# Altium project B106AA.PrjPcb (part 2 of 5)

## Sheet FOTA MicroController.SchDoc: FOTA MicroController
size A4; ApprovedBy: Mehmet Günce Akkoyun; CheckedBy: Mehmet Günce Akkoyun; Author: Mehmet Günce Akkoyun; CompanyName: Ovoo Electronics; DrawnBy: Mehmet Günce Akkoyun; Engineer: Mehmet Günce Akkoyun; Organization: Ovoo Electronics; Address1: Küçük Ýhsaniye Mah.; Address2: Mýzraklý Sok. No:15; Address3: Meram / Konya; Address4: Turkiye; DocumentNumber: AA005; Revision: B106AA; SheetNumber: 21; SheetTotal: 37
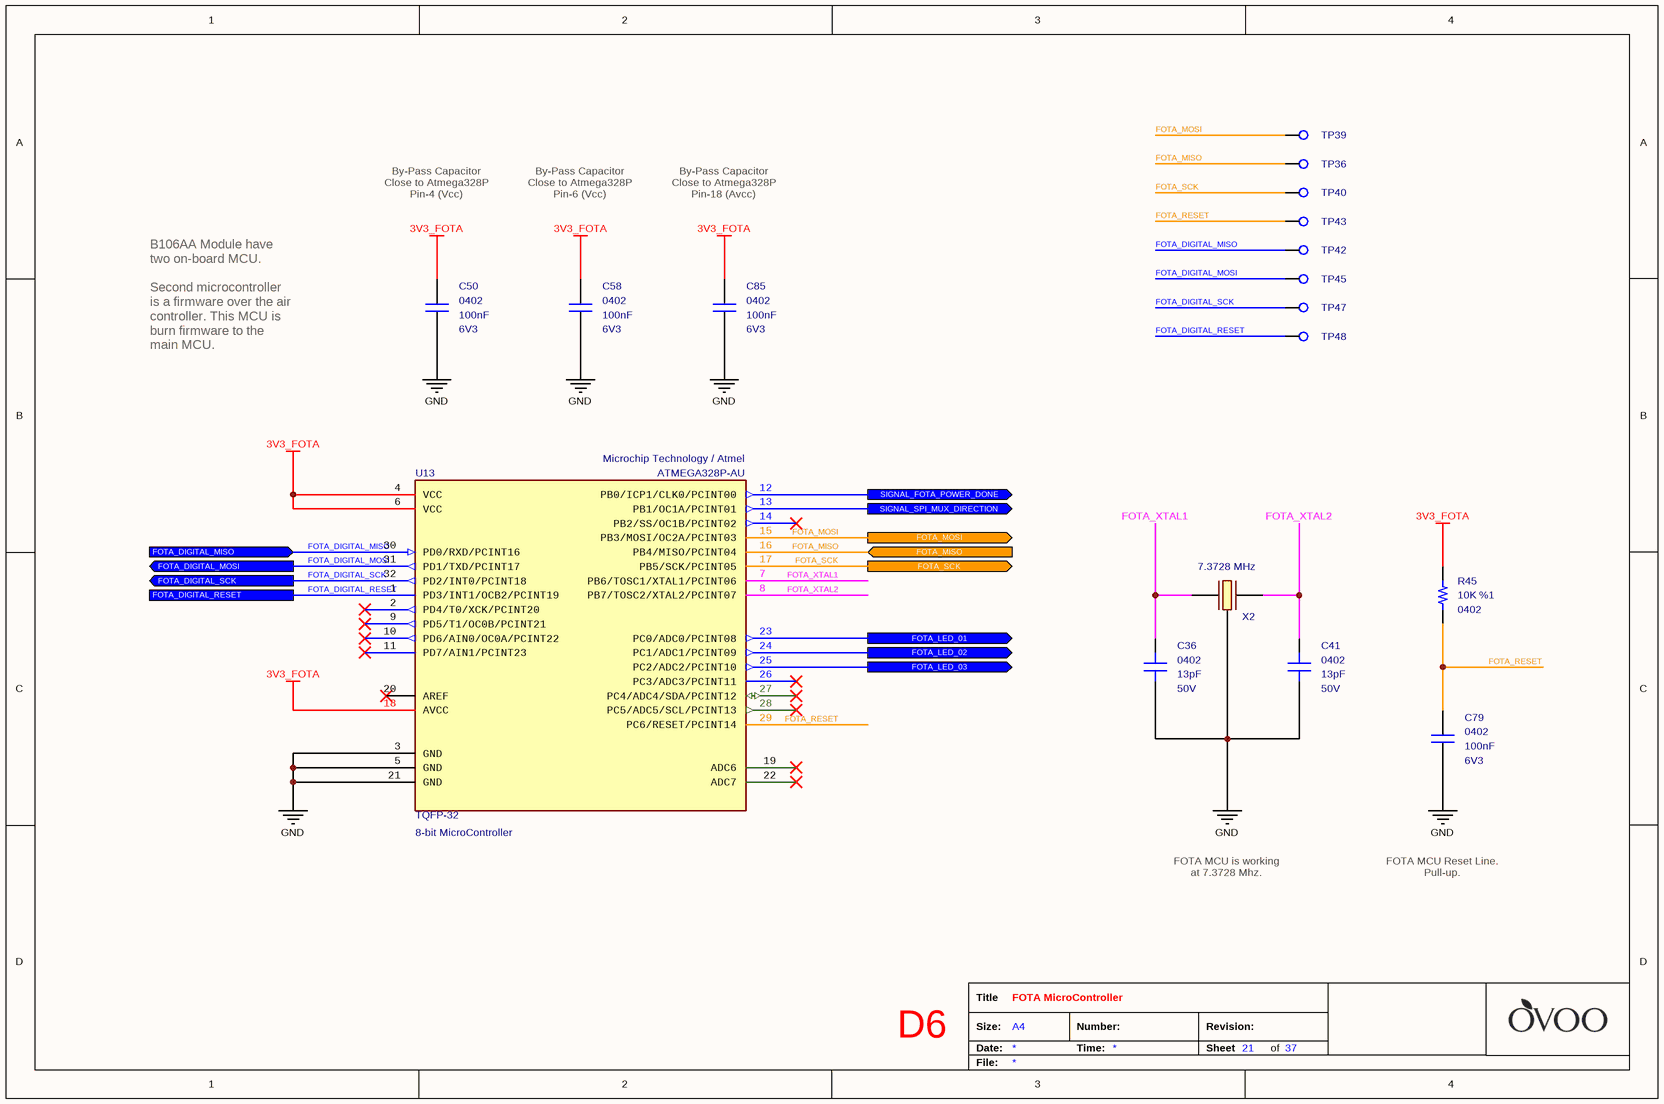
[diagram p10: FOTA MicroController.SchDoc]

### Parts
C36  value 13pF  Voltage: 50V  Case: 0402  [CAPACITOR_0402]  (hidden comment: Multilayer Ceramic Capacitors)
C41  value 13pF  Voltage: 50V  Case: 0402  [CAPACITOR_0402]  (hidden comment: Multilayer Ceramic Capacitors)
C50  value 100nF  Case: 0402  Voltage: 6V3  [CAPACITOR_0402]  (hidden comment: Multilayer Ceramic Capacitor)
C58  value 100nF  Case: 0402  Voltage: 6V3  [CAPACITOR_0402]  (hidden comment: Multilayer Ceramic Capacitor)
C79  value 100nF  Case: 0402  Voltage: 6V3  [CAPACITOR_0402]  (hidden comment: Multilayer Ceramic Capacitor)
C85  value 100nF  Case: 0402  Voltage: 6V3  [CAPACITOR_0402]  (hidden comment: Multilayer Ceramic Capacitor)
R45  value 10K  Tolerance: %1  Case: 0402  [RESISTOR_0402]  (hidden comment: Thick Film Resistor)
TP36  PCB - Test Point  [Test_Pad - Hole]  (value not drawn)  (no BOM)
TP39  PCB - Test Point  [Test_Pad - Hole]  (value not drawn)  (no BOM)
TP40  PCB - Test Point  [Test_Pad - Hole]  (value not drawn)  (no BOM)
TP42  PCB - Test Point  [Test_Pad - Hole]  (value not drawn)  (no BOM)
TP43  PCB - Test Point  [Test_Pad - Hole]  (value not drawn)  (no BOM)
TP45  PCB - Test Point  [Test_Pad - Hole]  (value not drawn)  (no BOM)
TP47  PCB - Test Point  [Test_Pad - Hole]  (value not drawn)  (no BOM)
TP48  PCB - Test Point  [Test_Pad - Hole]  (value not drawn)  (no BOM)
U13  8-bit MicroController  Manufacturer_Part_Number: ATMEGA328P-AU  Manufacturer_Name: Microchip Technology / Atmel  Case: TQFP-32  [TQFP32]
X2  7.3728 MHz  [ABRACON_CRYSTAL]

### Ports
FOTA_DIGITAL_MISO (in), FOTA_DIGITAL_MOSI (out), FOTA_DIGITAL_RESET, FOTA_DIGITAL_SCK (out), FOTA_LED_01 (out), FOTA_LED_02 (out), FOTA_LED_03 (out), FOTA_MISO (in), FOTA_MOSI (out), FOTA_SCK (out), SIGNAL_FOTA_POWER_DONE (out), SIGNAL_SPI_MUX_DIRECTION (out)

### Nets
3V3_FOTA: C50.2 C58.2 C85.2 R45.2 U13.4(VCC) U13.6(VCC) U13.18(AVCC)
GND: C36.1 C41.1 C50.1 C58.1 C79.1 C85.1 U13.3(GND) U13.5(GND) U13.21(GND) X2.2(GND)
FOTA_DIGITAL_MISO: TP42.1 U13.30(PD0/RXD/PCINT16) ; port FOTA_DIGITAL_MISO
FOTA_DIGITAL_MOSI: TP45.1 U13.31(PD1/TXD/PCINT17) ; port FOTA_DIGITAL_MOSI
FOTA_DIGITAL_RESET: TP48.1 U13.1(PD3/INT1/OCB2/PCINT19) ; port FOTA_DIGITAL_RESET
FOTA_DIGITAL_SCK: TP47.1 U13.32(PD2/INT0/PCINT18) ; port FOTA_DIGITAL_SCK
FOTA_MISO: TP36.1 U13.16(PB4/MISO/PCINT04) ; port FOTA_MISO
FOTA_MOSI: TP39.1 U13.15(PB3/MOSI/OC2A/PCINT03) ; port FOTA_MOSI
FOTA_RESET: C79.2 R45.1 TP43.1 U13.29(PC6/RESET/PCINT14)
FOTA_SCK: TP40.1 U13.17(PB5/SCK/PCINT05) ; port FOTA_SCK
FOTA_XTAL1: C36.2 U13.7(PB6/TOSC1/XTAL1/PCINT06) X2.3(OUT/IN)
FOTA_XTAL2: C41.2 U13.8(PB7/TOSC2/XTAL2/PCINT07) X2.1(IN/OUT)
NetC25_1: U13.23(PC0/ADC0/PCINT08) ; port FOTA_LED_01
NetC30_2: U13.12(PB0/ICP1/CLK0/PCINT00) ; port SIGNAL_FOTA_POWER_DONE
NetC39_1: U13.24(PC1/ADC1/PCINT09) ; port FOTA_LED_02
NetC67_1: U13.25(PC2/ADC2/PCINT10) ; port FOTA_LED_03
NetC69_2: U13.13(PB1/OC1A/PCINT01) ; port SIGNAL_SPI_MUX_DIRECTION

Not connected (* = marked no-connect by the designer): U13 2(PD4/T0/XCK/PCINT20)* 9(PD5/T1/OC0B/PCINT21)* 10(PD6/AIN0/OC0A/PCINT22)* 11(PD7/AIN1/PCINT23)* 14(PB2/SS/OC1B/PCINT02)* 19(ADC6)* 20(AREF)* 22(ADC7)* 26(PC3/ADC3/PCINT11)* 27(PC4/ADC4/SDA/PCINT12)* 28(PC5/ADC5/SCL/PCINT13)*; X2 4(GND)

### Notes on the sheet
- By-Pass Capacitor
  Close to Atmega328P
  Pin-4 (Vcc)
- By-Pass Capacitor
  Close to Atmega328P
  Pin-6 (Vcc)
- By-Pass Capacitor
  Close to Atmega328P
  Pin-18 (Avcc)
- B106AA Module have two on-board MCU.
  Second microcontroller is a firmware over the air controller. This MCU is burn firmware to the main MCU.
- FOTA MCU is working at 7.3728 Mhz.
- FOTA MCU Reset Line. Pull-up.
- D6
- Title
- Size:
- Date:
- A4
- Number:
- Time:
- Revision:
- Sheet
- of
- File:

### Library data of the parts
C36 C41 = Capacitor - 13pF [0402-50V): Capacitor - 13pF [0402] (Ceramic); Manufacturer_Name: Kemet; Manufacturer_Part_Number: CBR04C130F5GAC; Dielectric: C0G; Tolerance: 1%; Height: 0.55mm; Mouser_Part_Number: 80-CBR04C130F5GAC; ROHS: Yes; Weight: 0.65mg; ComponentLink1Description: DataSheet; ComponentLink1URL: http://www.kemet.com/Lists/ProductCatalog/Attachments/490/KEM_C1030_CBR_SMD.pdf; ComponentLink2Description: Mouser; ComponentLink2URL: http://www.mouser.com/Search/ProductDetail.aspx?qs=kSX8PZDGYstn%252bRHasf81FA%3d%3d; Supplier 1: Mouser; Supplier 2: Farnell; Supplier 3: Digi-Key; Supplier Part Number 3: 399-8812-1-ND; Supplier Part Number 2: 2773390; Supplier Part Number 1: 80-CBR04C130F5GAC
C50 C58 C79 C85 = Capacitor - 100nF [0402-6V3]: as C48 on sheet Master MicroController; Height: 0.25mm; Mouser_Part_Number: 581-04026D104KAT4A; ComponentLink1Description: Mouser; ComponentLink1URL: https://www.mouser.com.tr/ProductDetail/AVX/04026D104KAT4A?qs=sGAEpiMZZMs0AnBnWHyRQPg4iYkCw7IMED%2F4kpqgf7w%3D; ComponentLink2Description: DataSheet; ComponentLink2URL: https://www.mouser.com.tr/datasheet/2/40/cx5r-776519.pdf; ROHS: Yes; Maximum Operating Temperature: +85; Minimum Operating Temperature: -55; Supplier 1: Avnet; Supplier Part Number 1: 04026D104KAT4A
R45 = Resistor - 10K: Thick Film Resistors - SMD 1/16 W 10 Kohms 1%; Manufacturer_Name: Vishay; Manufacturer_Part_Number: CRCW040210K0FKED; Height: 0.4mm; Mouser_Part_Number: 71-CRCW0402-10K-E3; ComponentLink1Description: DataSheet; ComponentLink1URL: https://www.mouser.com.tr/datasheet/2/427/dcrcwe3-1762152.pdf; ComponentLink2Description: Mouser; ComponentLink2URL: https://www.mouser.com.tr/ProductDetail/Vishay-Dale/CRCW040210K0FKED?qs=sGAEpiMZZMu61qfTUdNhG2DpbjADlD3GcalbOv9utCY%3D; Supplier 1: Mouser; Supplier 2: Digi-Key; Supplier Part Number 1: 71-CRCW040210K0FKEDH; Supplier Part Number 2: 541-10.0KYCT-ND
TP36 TP39 TP40 TP42 TP43 TP45 TP47 TP48 = PCB - Test Point: Test Point
U13 = IC - ATMEGA328P: 8-bit Microcontrollers - MCU 32KB In-system Flash 20MHz 1.8V-5.5V; Supply Voltage - Min: 1.8V; Supply Voltage - Max: 5.5V; Height: 1mm; Mouser_Part_Number: 556-ATMEGA328P-AU; ComponentLink1Description: DataSheet; ComponentLink1URL: http://ww1.microchip.com/downloads/en/DeviceDoc/ATmega48A-PA-88A-PA-168A-PA-328-P-DS-DS40002061A.pdf; ROHS: Yes; Minimum Operating Temperature: -40; Maximum Operating Temperature: +85; ComponentLink2Description: Mouser; ComponentLink2URL: https://www.mouser.com.tr/ProductDetail/Microchip-Technology-Atmel/ATMEGA328P-AU?qs=sGAEpiMZZMtVoztFdqDXO3RbBx7FKCmV; ComponentLink3Description: ProductPage; ComponentLink3URL: https://www.microchip.com/wwwproducts/en/ATmega328p; Supplier 1: Avnet; Supplier 2: Mouser; Supplier 3: Arrow; Supplier 4: Digi-Key; Supplier Part Number 1: ATMEGA328P-AU; Supplier Part Number 2: 556-ATMEGA328P-AU; Supplier Part Number 3: ATMEGA328P-AU; Supplier Part Number 4: ATMEGA328P-AU-ND
X2 = Crystal - 7.3728 MHz (Abracon): Crystals 7.3728MHz 18pF -40C +85C; Manufacturer_Part_Number: ABMM2-7.3728MHZ-E2-T; ESR: 150 Ohms; Frequency Stability: 20 ppm; Height: 1.2 mm; Manufacturer_Name: ABRACON; Mouser_Part_Number: 815-ABMM2-7.3-E2-T; Frequency: 7.3728 MHz; Maximum Operating Temperature: +70; Minimum Operating Temperature: -20; ROHS: Yes; Tolerance: 20 ppm; ComponentLink1Description: DataSheet; ComponentLink1URL: https://www.ecsxtal.com/store/pdf/csm-8mr.pdf; ComponentLink2Description: Mouser; ComponentLink2URL: https://www.mouser.com/Search/Refine.aspx?Keyword=520-7.3-18-20BM-JENT; Supplier 1: Mouser; Supplier 2: Arrow; Supplier Part Number 2: ABMM2-7.3728MHZ-E2-T; Supplier Part Number 1: 815-ABMM2-7.3-E2-T

## Sheet FOTA MicroController Status LEDs.SchDoc: FOTA Microcontroller Status LED's
size A4; ApprovedBy: Mehmet Günce Akkoyun; CheckedBy: Mehmet Günce Akkoyun; Author: Mehmet Günce Akkoyun; CompanyName: Ovoo Electronics; DrawnBy: Mehmet Günce Akkoyun; Engineer: Mehmet Günce Akkoyun; Organization: Ovoo Electronics; Address1: Küçük Ýhsaniye Mah.; Address2: Mýzraklý Sok. No:15; Address3: Meram / Konya; Address4: Turkiye; DocumentNumber: AA005; Revision: B106AA; SheetNumber: 22; SheetTotal: 37
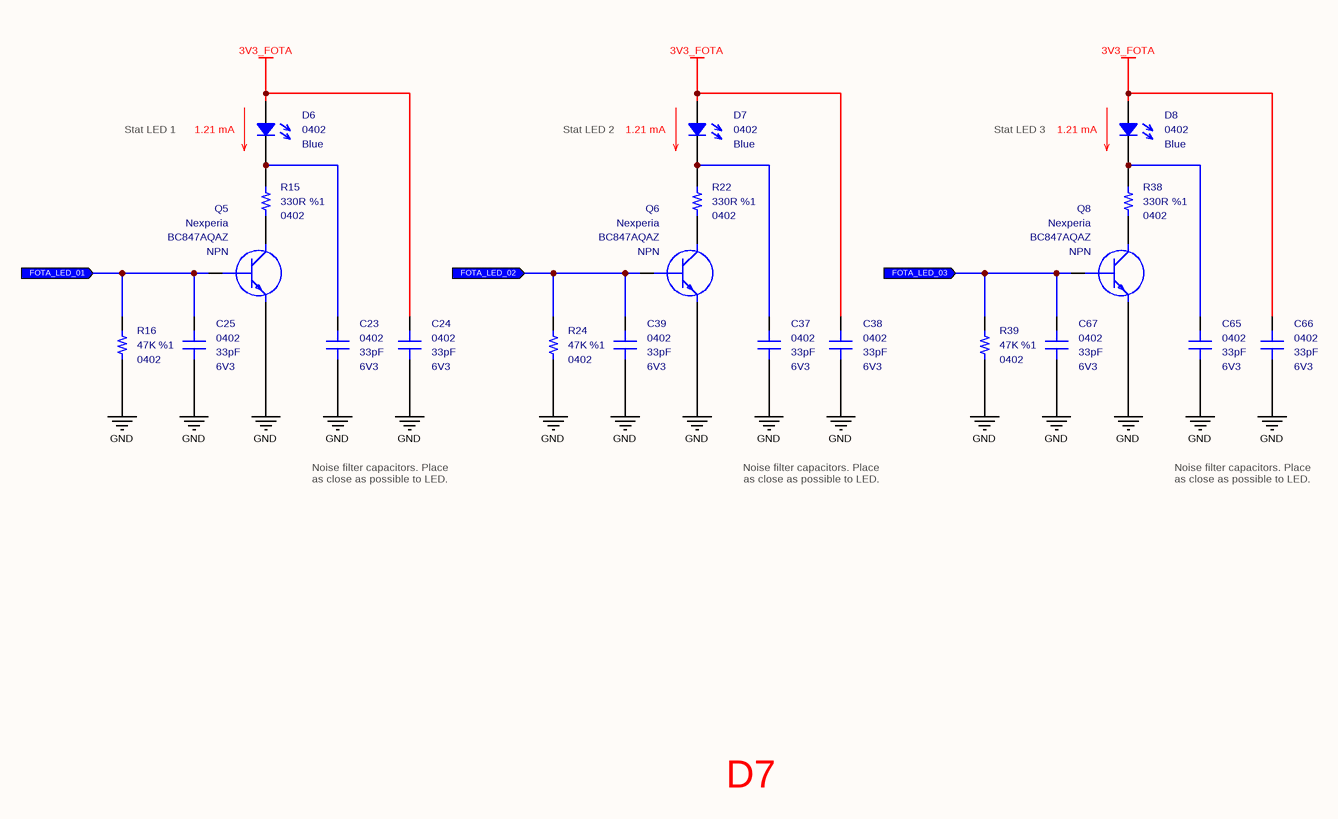
[diagram p11: FOTA MicroController Status LEDs.SchDoc]

### Parts
C23  value 33pF  Case: 0402  Voltage: 6V3  [CAPACITOR_0402]  (hidden comment: Multilayer Ceramic Capacitor)
C24  value 33pF  Case: 0402  Voltage: 6V3  [CAPACITOR_0402]  (hidden comment: Multilayer Ceramic Capacitor)
C25  value 33pF  Case: 0402  Voltage: 6V3  [CAPACITOR_0402]  (hidden comment: Multilayer Ceramic Capacitor)
C37  value 33pF  Case: 0402  Voltage: 6V3  [CAPACITOR_0402]  (hidden comment: Multilayer Ceramic Capacitor)
C38  value 33pF  Case: 0402  Voltage: 6V3  [CAPACITOR_0402]  (hidden comment: Multilayer Ceramic Capacitor)
C39  value 33pF  Case: 0402  Voltage: 6V3  [CAPACITOR_0402]  (hidden comment: Multilayer Ceramic Capacitor)
C65  value 33pF  Case: 0402  Voltage: 6V3  [CAPACITOR_0402]  (hidden comment: Multilayer Ceramic Capacitor)
C66  value 33pF  Case: 0402  Voltage: 6V3  [CAPACITOR_0402]  (hidden comment: Multilayer Ceramic Capacitor)
C67  value 33pF  Case: 0402  Voltage: 6V3  [CAPACITOR_0402]  (hidden comment: Multilayer Ceramic Capacitor)
D6  Case: 0402  Color: Blue  [LED_0402]  (hidden comment: SMD LED (Blue))
D7  Case: 0402  Color: Blue  [LED_0402]  (hidden comment: SMD LED (Blue))
D8  Case: 0402  Color: Blue  [LED_0402]  (hidden comment: SMD LED (Blue))
Q5  Manufacturer_Name: Nexperia  Manufacturer_Part_Number: BC847AQAZ  Polarity: NPN  [SOT1215]  (hidden comment: Bipolar NPN Transistors)
Q6  Manufacturer_Name: Nexperia  Manufacturer_Part_Number: BC847AQAZ  Polarity: NPN  [SOT1215]  (hidden comment: Bipolar NPN Transistors)
Q8  Manufacturer_Name: Nexperia  Manufacturer_Part_Number: BC847AQAZ  Polarity: NPN  [SOT1215]  (hidden comment: Bipolar NPN Transistors)
R15  value 330R  Tolerance: %1  Case: 0402  [RESISTOR_0402]  (hidden comment: Thick Film Resistor)
R16  value 47K  Tolerance: %1  Case: 0402  [RESISTOR_0402]  (hidden comment: Thick Film Resistor)
R22  value 330R  Tolerance: %1  Case: 0402  [RESISTOR_0402]  (hidden comment: Thick Film Resistor)
R24  value 47K  Tolerance: %1  Case: 0402  [RESISTOR_0402]  (hidden comment: Thick Film Resistor)
R38  value 330R  Tolerance: %1  Case: 0402  [RESISTOR_0402]  (hidden comment: Thick Film Resistor)
R39  value 47K  Tolerance: %1  Case: 0402  [RESISTOR_0402]  (hidden comment: Thick Film Resistor)

### Ports
FOTA_LED_01 (in), FOTA_LED_02 (in), FOTA_LED_03 (in)

### Nets
3V3_FOTA: C24.1 C38.1 C66.1 D6.2 D7.2 D8.2
GND: C23.2 C24.2 C25.2 C37.2 C38.2 C39.2 C65.2 C66.2 C67.2 Q5.2(E) Q6.2(E) Q8.2(E) R16.1 R24.1 R39.1
NetC23_1: C23.1 D6.1 R15.2
NetC25_1: C25.1 Q5.1(B) R16.2 ; port FOTA_LED_01
NetC37_1: C37.1 D7.1 R22.2
NetC39_1: C39.1 Q6.1(B) R24.2 ; port FOTA_LED_02
NetC65_1: C65.1 D8.1 R38.2
NetC67_1: C67.1 Q8.1(B) R39.2 ; port FOTA_LED_03
NetQ5_3: Q5.3(C) R15.1
NetQ6_3: Q6.3(C) R22.1
NetQ8_3: Q8.3(C) R38.1

### Notes on the sheet
- Stat LED 1
- (near D6) 1.21 mA
- Stat LED 2
- (near D7) 1.21 mA
- Stat LED 3
- (near D8) 1.21 mA
- Noise filter capacitors. Place as close as possible to LED.
- D7
- Title
- Size:
- Date:
- A4
- Number:
- Time:
- Revision:
- Sheet
- of
- File:

### Library data of the parts
C23-C25 C37-C39 C65-C67 = Capacitor - 33pF [0402-6V3]: as C30 on sheet FOTA MicroController Power Trigger; Height: 0.5mm; Mouser_Part_Number: 80-C0402C330J9RAUTO; Maximum Operating Temperature: +125; Minimum Operating Temperature: -55; ROHS: Yes; ComponentLink1Description: DataSheet; ComponentLink1URL: https://api.kemet.com/component-edge/download/datasheet/C0402C330J9RACAUTO.pdf; ComponentLink2Description: Mouser; ComponentLink2URL: https://www.mouser.com/Search/Refine.aspx?Keyword=80-C0402C330J9RAUTO; Supplier 1: Mouser; Supplier Part Number 1: 80-C0402C330J9RAUTO
D6-D8 = Diode - LED (0402-Blue): Standard LEDs - SMD PICOLEDTM;BLUE LED; 25M @ 5MA; Manufacturer_Name: ROHM Semiconductor; Manufacturer_Part_Number: SMLP13BC8TT86; Mouser_Part_Number: 755-SMLP13BC8TT86; ROHS: Yes; ComponentLink1Description: DataSheet; ComponentLink1URL: https://d1d2qsbl8m0m72.cloudfront.net/en/products/databook/datasheet/opto/led/chip_mono/sml-p1-e.pdf; ComponentLink2Description: Mouser; ComponentLink2URL: https://www.mouser.com.tr/ProductDetail/ROHM-Semiconductor/SMLP13BC8TT86?qs=%2Fha2pyFaduidYDgXFKL%252BNZwCVZNUI4FlyPWWbVDx1b6ABmzS%252BS2f0w%3D%3D; Supplier 1: Mouser; Supplier 2: Digi-Key; Supplier Part Number 1: 755-SMLP13BC8TT86; Supplier Part Number 2: 846-1112-1-ND
Q5 Q6 Q8 = Transistor - BC847: Bipolar Transistors - BJT BC847AQA/DFN1010D-3/REEL 7" Q2; Mouser_Part_Number: 771-BC847AQAZ; ComponentLink1Description: DataSheet; ComponentLink1URL: https://www.mouser.com.tr/datasheet/2/916/BC847XQA_SER-1598405.pdf; ComponentLink2Description: Mouser; ComponentLink2URL: https://www.mouser.com.tr/ProductDetail/Nexperia/BC847AQAZ?qs=%2Fha2pyFaduhKMCPKNtQimeJpXTw9z4AqURd2YARs8DVICZNv3AT9Dw%3D%3D; Case: DFN-1010D-3; Supplier 1: Mouser; Supplier 2: Digi-Key; Supplier Part Number 1: 771-BC847AQAZ; Supplier Part Number 2: 1727-2545-1-ND
R15 R22 R38 = Resistor - 330R: as R21 on sheet FOTA MicroController Power Switch; Height: 0.4mm; Mouser_Part_Number: 71-CRCW0402-330-E3; ComponentLink1Description: DataSheet; ComponentLink1URL: https://www.mouser.com.tr/datasheet/2/427/dcrcwe3-1762152.pdf; ComponentLink2Description: Mouser; ComponentLink2URL: https://www.mouser.com.tr/ProductDetail/Vishay-Dale/CRCW0402330RFKED?qs=sGAEpiMZZMu61qfTUdNhG2DpbjADlD3GGS6SwBlLi5Q%3D; Supplier 1: Mouser; Supplier 2: Digi-Key; Supplier Part Number 2: 541-330LCT-ND; Supplier Part Number 1: 71-CRCW0402-330-E3
R16 R24 R39 = Resistor - 47K: as R20 on sheet FOTA MicroController Power Trigger; Height: 0.4mm; Mouser_Part_Number: 71-CRCW0402-47K-E3; ComponentLink1Description: DataSheet; ComponentLink1URL: https://www.mouser.com.tr/datasheet/2/427/dcrcwe3-1762152.pdf; ComponentLink2Description: Mouser; ComponentLink2URL: https://www.mouser.com.tr/ProductDetail/Vishay-Dale/CRCW040247K0FKED?qs=sGAEpiMZZMu61qfTUdNhG2DpbjADlD3GL%252B3h1elTxqU%3D; Supplier 1: Mouser; Supplier 2: Digi-Key; Supplier Part Number 1: 71-CRCW040247K0FKEDH; Supplier Part Number 2: 541-47.0KYCT-ND

## Sheet GSM IoT.SchDoc: GSM IoT Block Diagram
size A3; ApprovedBy: Mehmet Günce Akkoyun; CheckedBy: Mehmet Günce Akkoyun; Author: Mehmet Günce Akkoyun; CompanyName: Ovoo Electronics; DrawnBy: Mehmet Günce Akkoyun; Engineer: Mehmet Günce Akkoyun; Organization: Ovoo Electronics; Address1: Küçük Ýhsaniye Mah.; Address2: Mýzraklý Sok. No:15; Address3: Meram / Konya; Address4: Turkiye; DocumentNumber: AA005; Revision: B106AA; SheetNumber: 23; SheetTotal: 37
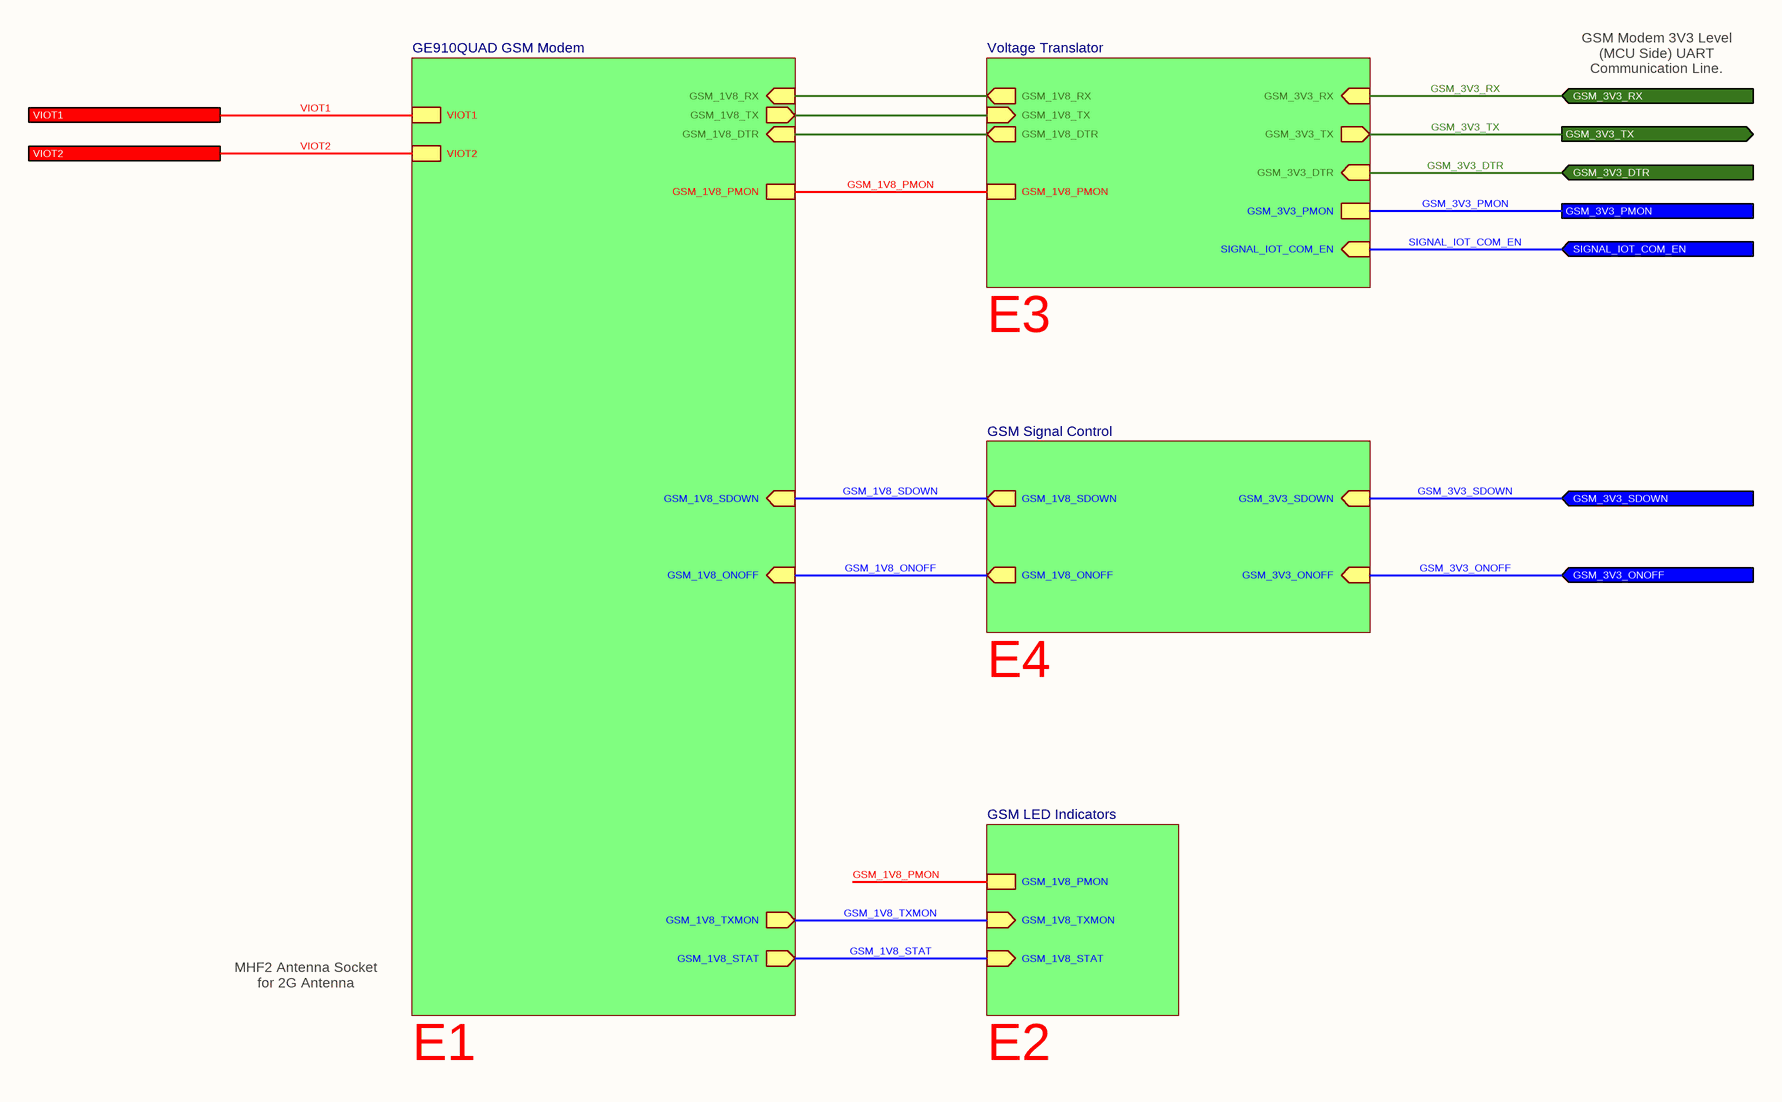
[diagram p12: GSM IoT.SchDoc]

### Sub-sheets
GE910QUAD GSM Modem = GE910QUAD Modem.SchDoc: GSM_1V8_STAT (out), GSM_1V8_TXMON (out), VIOT2, VIOT1, GSM_1V8_SDOWN (in), GSM_1V8_ONOFF (in), GSM_1V8_PMON, GSM_1V8_TX (out), GSM_1V8_RX (in), GSM_1V8_DTR (in)
GSM LED Indicators = GSM LED Indicators.SchDoc: GSM_1V8_PMON, GSM_1V8_TXMON (in), GSM_1V8_STAT (in)
GSM Signal Control = GSM Signal Control.SchDoc: GSM_3V3_SDOWN (in), GSM_1V8_SDOWN (out), GSM_1V8_ONOFF (out), GSM_3V3_ONOFF (in)
Voltage Translator = Bidirectional Voltage Translator.SchDoc: GSM_3V3_PMON, SIGNAL_IOT_COM_EN (in), GSM_1V8_PMON, GSM_3V3_RX (in), GSM_3V3_TX (out), GSM_1V8_RX (out), GSM_1V8_TX (in), GSM_3V3_DTR (in), GSM_1V8_DTR (out)

### Ports
GSM_3V3_DTR (in), GSM_3V3_ONOFF (in), GSM_3V3_PMON, GSM_3V3_RX (in), GSM_3V3_SDOWN (in), GSM_3V3_TX (out), SIGNAL_IOT_COM_EN (in), VIOT1, VIOT2

### Nets
GSM_1V8_DTR: sheet GE910QUAD GSM Modem/GSM_1V8_DTR, sheet Voltage Translator/GSM_1V8_DTR
GSM_1V8_ONOFF: sheet GSM Signal Control/GSM_1V8_ONOFF, sheet GE910QUAD GSM Modem/GSM_1V8_ONOFF
GSM_1V8_PMON: sheet GE910QUAD GSM Modem/GSM_1V8_PMON, sheet GSM LED Indicators/GSM_1V8_PMON, sheet Voltage Translator/GSM_1V8_PMON
GSM_1V8_RX: sheet GE910QUAD GSM Modem/GSM_1V8_RX, sheet Voltage Translator/GSM_1V8_RX
GSM_1V8_SDOWN: sheet GSM Signal Control/GSM_1V8_SDOWN, sheet GE910QUAD GSM Modem/GSM_1V8_SDOWN
GSM_1V8_STAT: sheet GE910QUAD GSM Modem/GSM_1V8_STAT, sheet GSM LED Indicators/GSM_1V8_STAT
GSM_1V8_TX: sheet GE910QUAD GSM Modem/GSM_1V8_TX, sheet Voltage Translator/GSM_1V8_TX
GSM_1V8_TXMON: sheet GE910QUAD GSM Modem/GSM_1V8_TXMON, sheet GSM LED Indicators/GSM_1V8_TXMON
GSM_3V3_DTR: port GSM_3V3_DTR, sheet Voltage Translator/GSM_3V3_DTR
GSM_3V3_ONOFF: port GSM_3V3_ONOFF, sheet GSM Signal Control/GSM_3V3_ONOFF
GSM_3V3_PMON: port GSM_3V3_PMON, sheet Voltage Translator/GSM_3V3_PMON
GSM_3V3_RX: port GSM_3V3_RX, sheet Voltage Translator/GSM_3V3_RX
GSM_3V3_SDOWN: port GSM_3V3_SDOWN, sheet GSM Signal Control/GSM_3V3_SDOWN
GSM_3V3_TX: port GSM_3V3_TX, sheet Voltage Translator/GSM_3V3_TX
SIGNAL_IOT_COM_EN: port SIGNAL_IOT_COM_EN, sheet Voltage Translator/SIGNAL_IOT_COM_EN
VIOT1: port VIOT1, sheet GE910QUAD GSM Modem/VIOT1
VIOT2: port VIOT2, sheet GE910QUAD GSM Modem/VIOT2

### Notes on the sheet
- GSM Modem 3V3 Level (MCU Side) UART Communication Line.
- E3
- E4
- MHF2 Antenna Socket
  for 2G Antenna
- E1
- E2
- Title
- Size:
- Date:
- A3
- Number:
- Time:
- Revision:
- Sheet
- of
- File:

## Sheet GSM Signal Control.SchDoc: GSM Control Signal Management
size A4; ApprovedBy: Mehmet Günce Akkoyun; CheckedBy: Mehmet Günce Akkoyun; Author: Mehmet Günce Akkoyun; CompanyName: Ovoo Electronics; DrawnBy: Mehmet Günce Akkoyun; Engineer: Mehmet Günce Akkoyun; Organization: Ovoo Electronics; Address1: Küçük Ýhsaniye Mah.; Address2: Mýzraklý Sok. No:15; Address3: Meram / Konya; Address4: Turkiye; DocumentNumber: AA005; Revision: B106AA; SheetNumber: 27; SheetTotal: 37
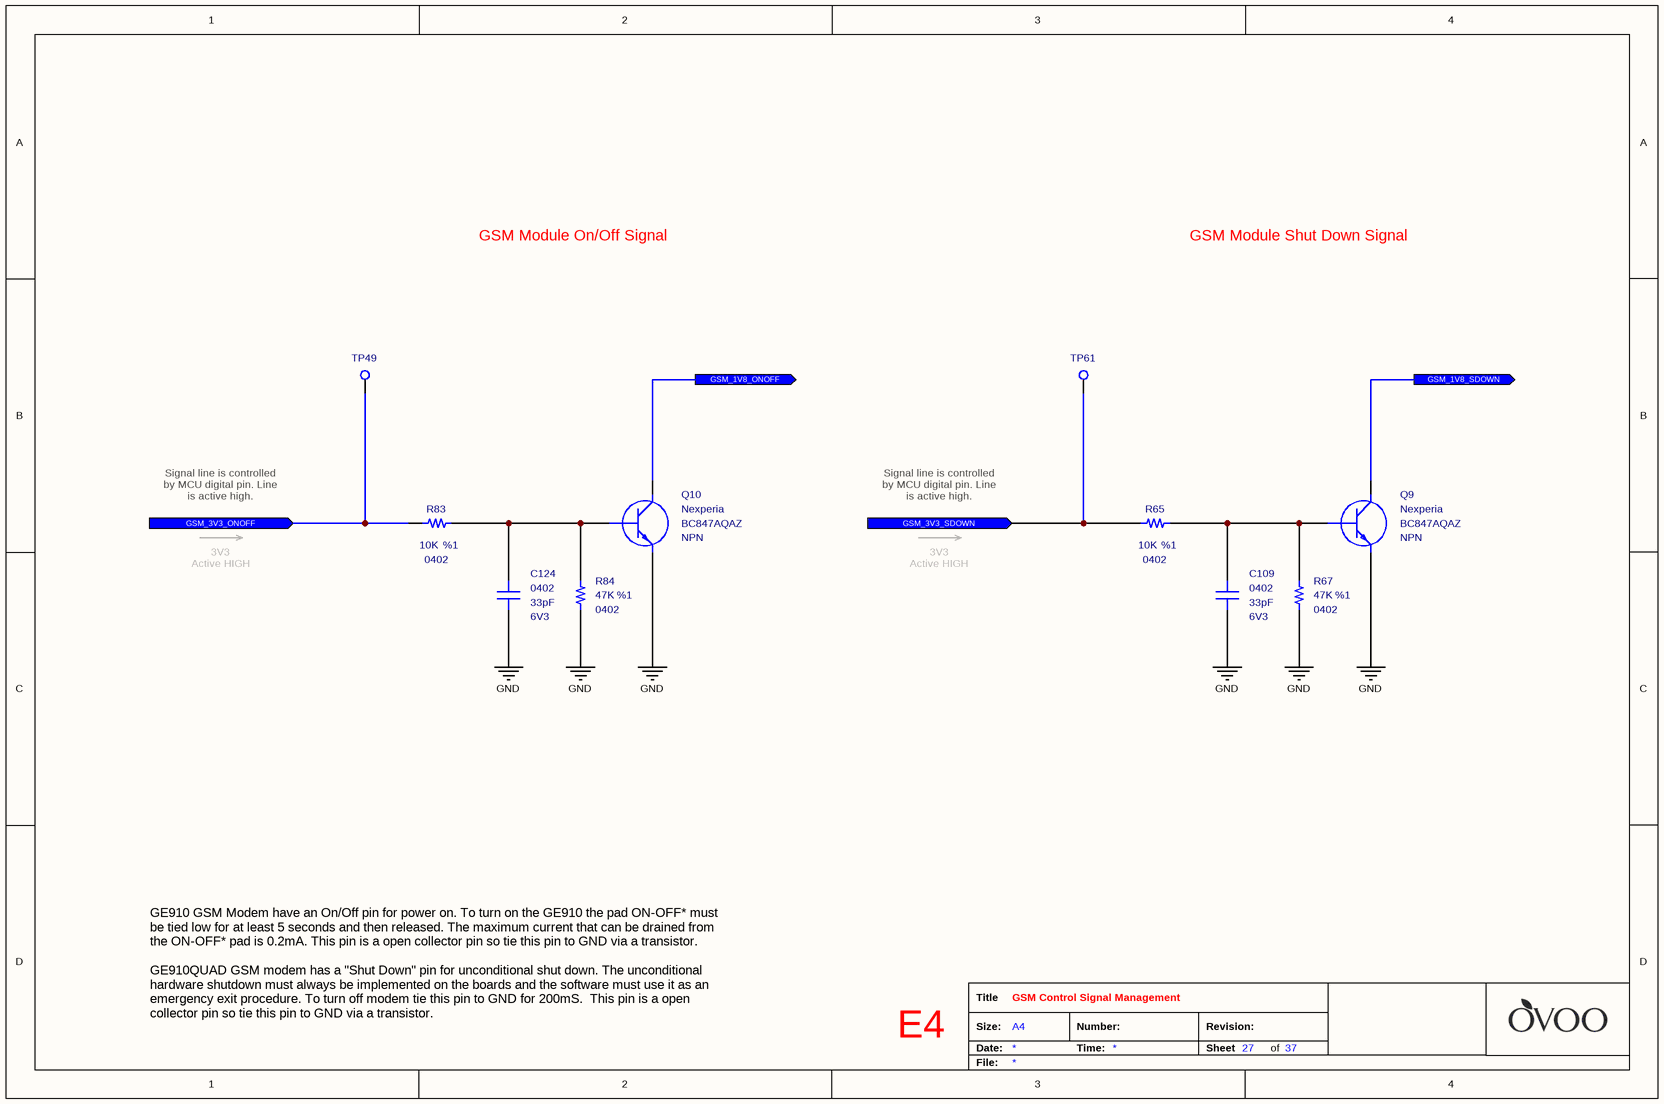
[diagram p13: GSM Signal Control.SchDoc]

### Parts
C109  value 33pF  Case: 0402  Voltage: 6V3  [CAPACITOR_0402]  (hidden comment: Multilayer Ceramic Capacitor)
C124  value 33pF  Case: 0402  Voltage: 6V3  [CAPACITOR_0402]  (hidden comment: Multilayer Ceramic Capacitor)
Q9  Manufacturer_Name: Nexperia  Manufacturer_Part_Number: BC847AQAZ  Polarity: NPN  [SOT1215]  (hidden comment: Bipolar NPN Transistors)
Q10  Manufacturer_Name: Nexperia  Manufacturer_Part_Number: BC847AQAZ  Polarity: NPN  [SOT1215]  (hidden comment: Bipolar NPN Transistors)
R65  value 10K  Tolerance: %1  Case: 0402  [RESISTOR_0402]  (hidden comment: Thick Film Resistor)
R67  value 47K  Tolerance: %1  Case: 0402  [RESISTOR_0402]  (hidden comment: Thick Film Resistor)
R83  value 10K  Tolerance: %1  Case: 0402  [RESISTOR_0402]  (hidden comment: Thick Film Resistor)
R84  value 47K  Tolerance: %1  Case: 0402  [RESISTOR_0402]  (hidden comment: Thick Film Resistor)
TP49  PCB - Test Point  [Test_Pad - Hole]  (value not drawn)  (no BOM)
TP61  PCB - Test Point  [Test_Pad - Hole]  (value not drawn)  (no BOM)

### Ports
GSM_1V8_ONOFF (out), GSM_1V8_SDOWN (out), GSM_3V3_ONOFF (in), GSM_3V3_SDOWN (in)

### Nets
GND: C109.2 C124.2 Q9.2(E) Q10.2(E) R67.1 R84.1
GSM_1V8_ONOFF: Q10.3(C) ; port GSM_1V8_ONOFF
GSM_1V8_SDOWN: Q9.3(C) ; port GSM_1V8_SDOWN
GSM_3V3_ONOFF: R83.2 TP49.1 ; port GSM_3V3_ONOFF
GSM_3V3_SDOWN: R65.2 TP61.1 ; port GSM_3V3_SDOWN
NetC109_1: C109.1 Q9.1(B) R65.1 R67.2
NetC124_1: C124.1 Q10.1(B) R83.1 R84.2

### Notes on the sheet
- GSM Module On/Off Signal
- GSM Module Shut Down Signal
- Signal line is controlled by MCU digital pin. Line is active high.
- 3V3
  Active HIGH
- GE910 GSM Modem have an On/Off pin for power on. To turn on the GE910 the pad ON-OFF* must be tied low for at least 5 seconds and then released. The maximum current that can be drained from the ON-OFF* pad is 0.2mA. This pin is a open collector pin so tie this pin to GND via a transistor.
  GE910QUAD GSM modem has a "Shut Down" pin for unconditional shut down. The unconditional hardware shutdown must always be implemented on the boards and the software must use it as an emergency exit procedure. To turn off modem tie this pin to GND for 200mS.  This pin is a open collector pin so tie this pin to GND via a transistor.
- E4
- Title
- Size:
- Date:
- A4
- Number:
- Time:
- Revision:
- Sheet
- of
- File:

### Library data of the parts
C109 C124 = Capacitor - 33pF [0402-6V3]: as C30 on sheet FOTA MicroController Power Trigger; Height: 0.5mm; Mouser_Part_Number: 80-C0402C330J9RAUTO; Maximum Operating Temperature: +125; Minimum Operating Temperature: -55; ROHS: Yes; ComponentLink1Description: DataSheet; ComponentLink1URL: https://api.kemet.com/component-edge/download/datasheet/C0402C330J9RACAUTO.pdf; ComponentLink2Description: Mouser; ComponentLink2URL: https://www.mouser.com/Search/Refine.aspx?Keyword=80-C0402C330J9RAUTO; Supplier 1: Mouser; Supplier Part Number 1: 80-C0402C330J9RAUTO
Q9 Q10 = Transistor - BC847: as Q5 on sheet FOTA MicroController Status LEDs; Mouser_Part_Number: 771-BC847AQAZ; ComponentLink1Description: DataSheet; ComponentLink1URL: https://www.mouser.com.tr/datasheet/2/916/BC847XQA_SER-1598405.pdf; ComponentLink2Description: Mouser; ComponentLink2URL: https://www.mouser.com.tr/ProductDetail/Nexperia/BC847AQAZ?qs=%2Fha2pyFaduhKMCPKNtQimeJpXTw9z4AqURd2YARs8DVICZNv3AT9Dw%3D%3D; Case: DFN-1010D-3; Supplier 1: Mouser; Supplier 2: Digi-Key; Supplier Part Number 1: 771-BC847AQAZ; Supplier Part Number 2: 1727-2545-1-ND
R65 R83 = Resistor - 10K: as R45 on sheet FOTA MicroController; Height: 0.4mm; Mouser_Part_Number: 71-CRCW0402-10K-E3; ComponentLink1Description: DataSheet; ComponentLink1URL: https://www.mouser.com.tr/datasheet/2/427/dcrcwe3-1762152.pdf; ComponentLink2Description: Mouser; ComponentLink2URL: https://www.mouser.com.tr/ProductDetail/Vishay-Dale/CRCW040210K0FKED?qs=sGAEpiMZZMu61qfTUdNhG2DpbjADlD3GcalbOv9utCY%3D; Supplier 1: Mouser; Supplier 2: Digi-Key; Supplier Part Number 1: 71-CRCW040210K0FKEDH; Supplier Part Number 2: 541-10.0KYCT-ND
R67 R84 = Resistor - 47K: as R20 on sheet FOTA MicroController Power Trigger; Height: 0.4mm; Mouser_Part_Number: 71-CRCW0402-47K-E3; ComponentLink1Description: DataSheet; ComponentLink1URL: https://www.mouser.com.tr/datasheet/2/427/dcrcwe3-1762152.pdf; ComponentLink2Description: Mouser; ComponentLink2URL: https://www.mouser.com.tr/ProductDetail/Vishay-Dale/CRCW040247K0FKED?qs=sGAEpiMZZMu61qfTUdNhG2DpbjADlD3GL%252B3h1elTxqU%3D; Supplier 1: Mouser; Supplier 2: Digi-Key; Supplier Part Number 1: 71-CRCW040247K0FKEDH; Supplier Part Number 2: 541-47.0KYCT-ND
TP49 TP61 = PCB - Test Point: Test Point

## Sheet GE910QUAD Modem.SchDoc: GE910 GSM Modem & SIM
size A3; ApprovedBy: Mehmet Günce Akkoyun; CheckedBy: Mehmet Günce Akkoyun; Author: Mehmet Günce Akkoyun; CompanyName: Ovoo Electronics; DrawnBy: Mehmet Günce Akkoyun; Engineer: Mehmet Günce Akkoyun; Organization: Ovoo Electronics; Address1: Küçük Ýhsaniye Mah.; Address2: Mýzraklý Sok. No:15; Address3: Meram / Konya; Address4: Turkiye; DocumentNumber: AA005; Revision: B106AA; SheetNumber: 24; SheetTotal: 37
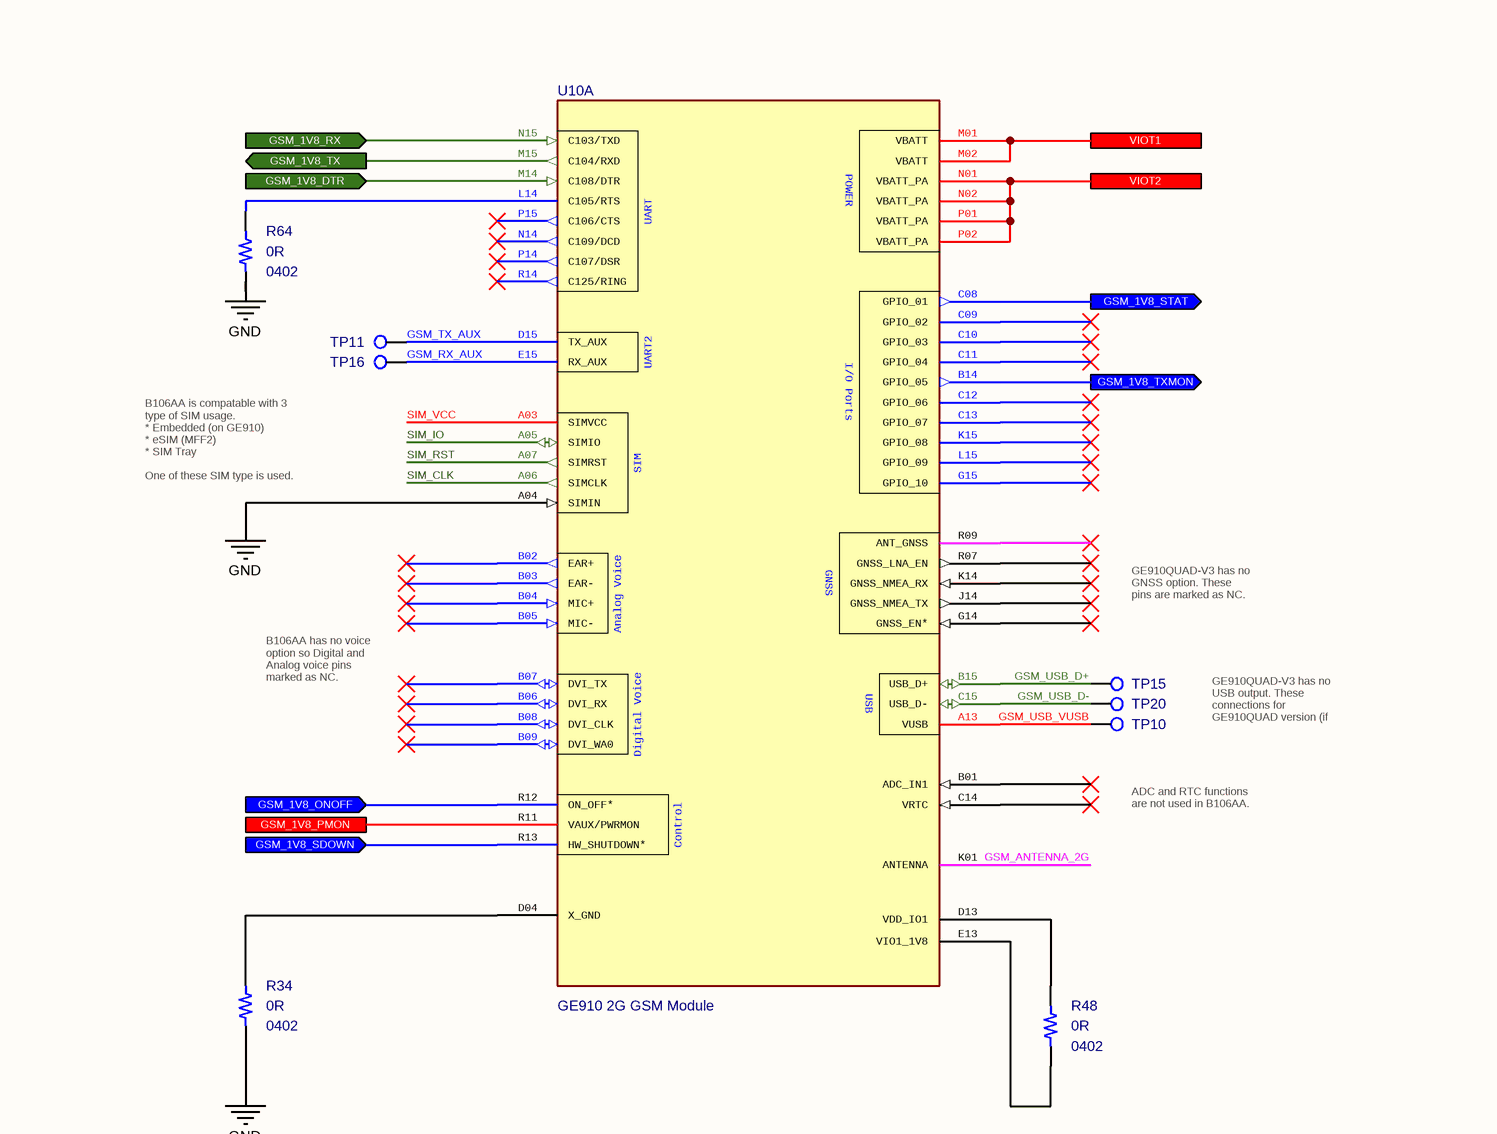
[diagram p14: GE910QUAD Modem.SchDoc, top left]
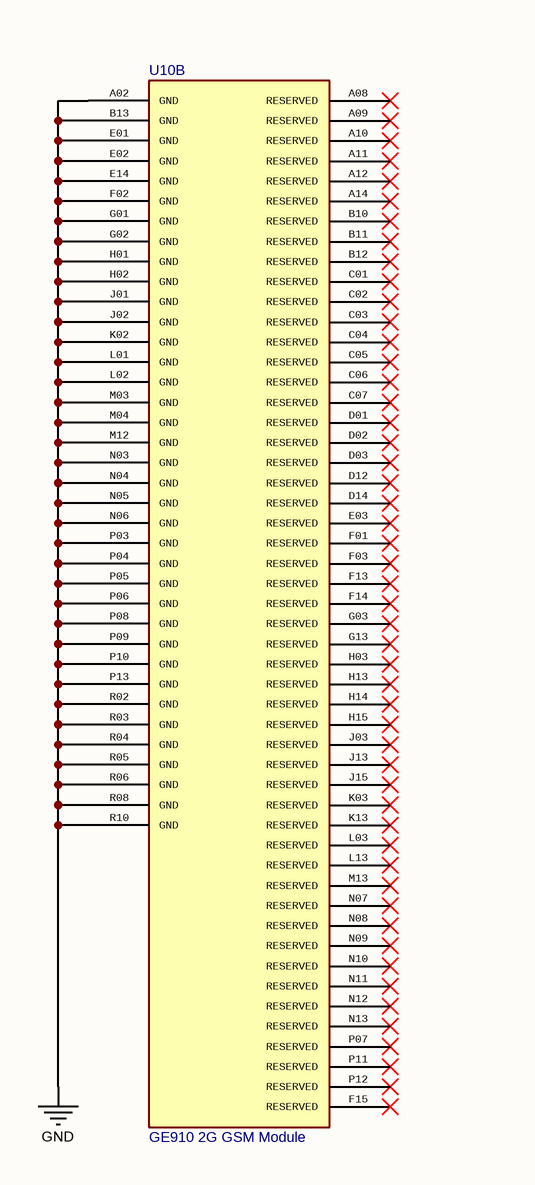
[diagram p15: GE910QUAD Modem.SchDoc, top right]
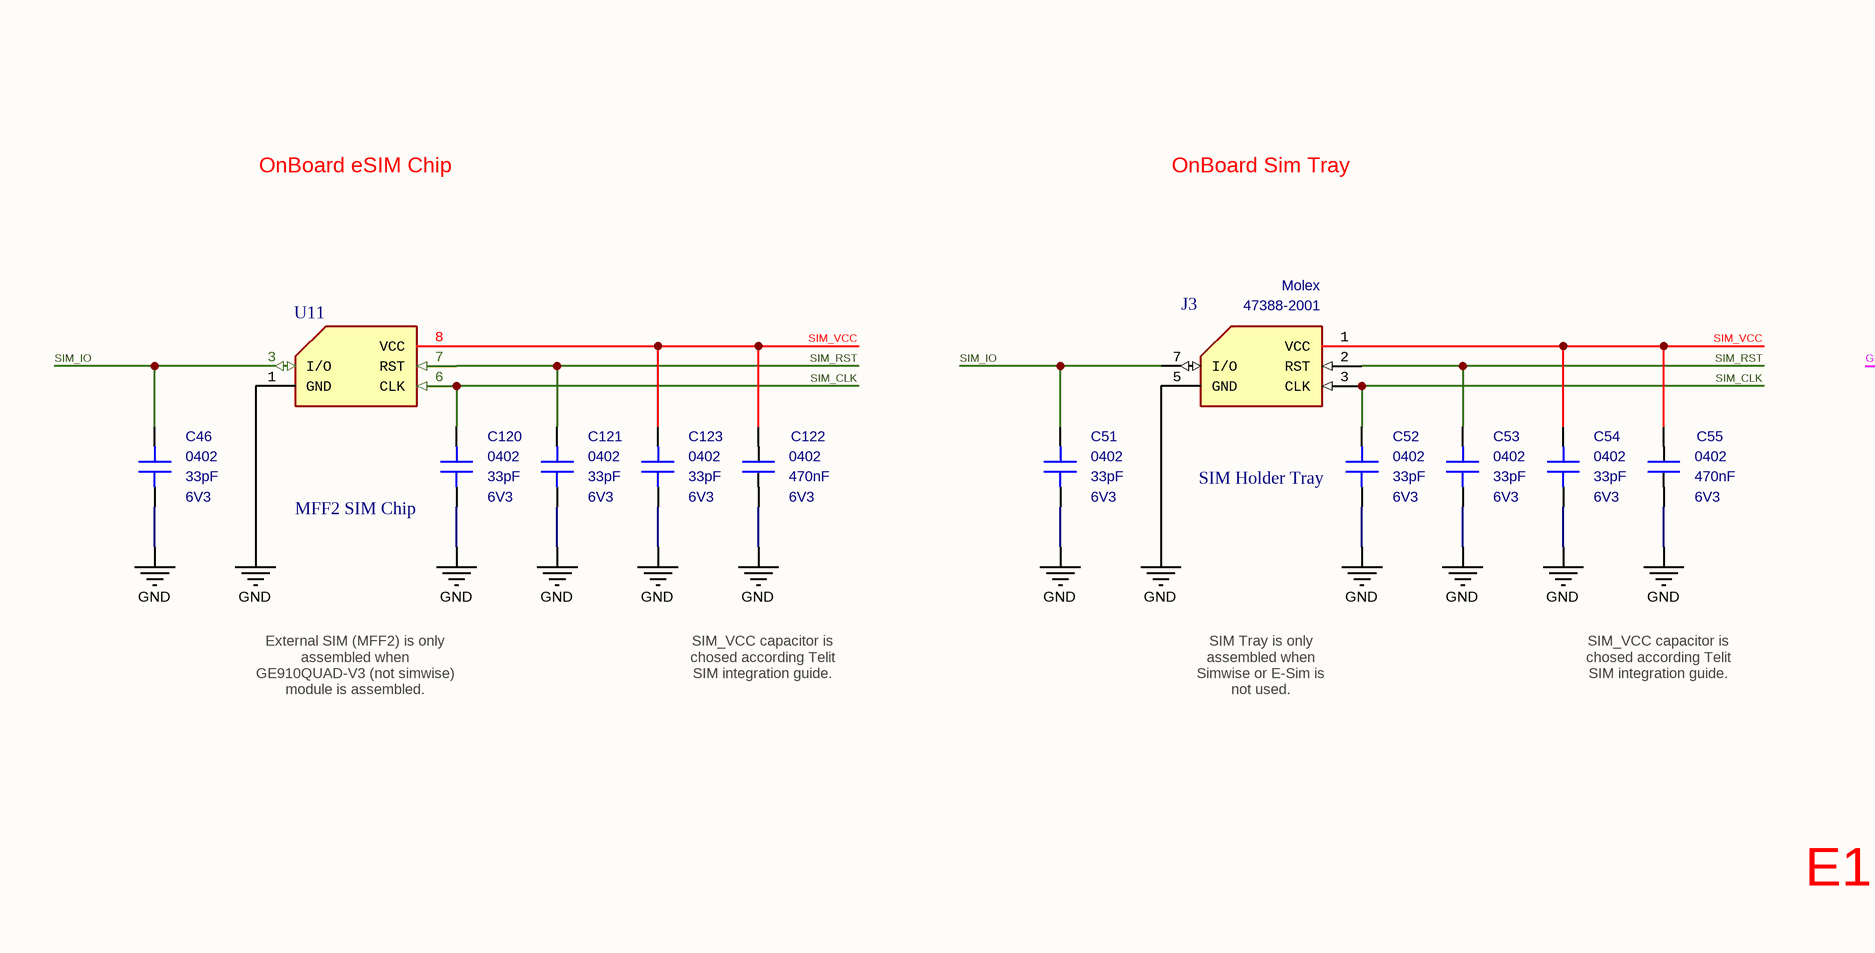
[diagram p16: GE910QUAD Modem.SchDoc, bottom left]
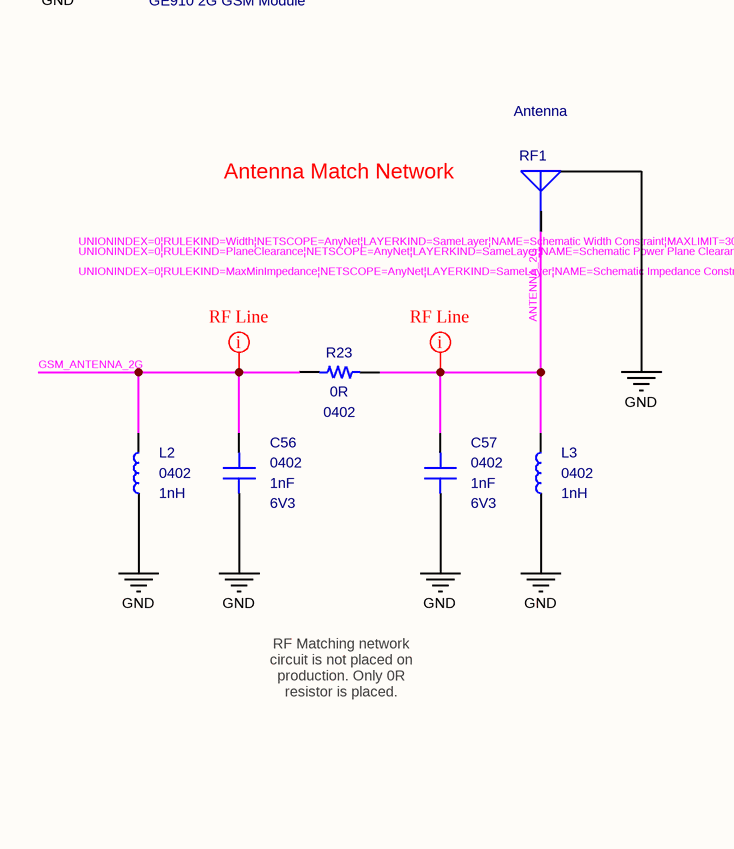
[diagram p17: GE910QUAD Modem.SchDoc, bottom right]

### Parts
C46  value 33pF  Case: 0402  Voltage: 6V3  [CAPACITOR_0402]  (hidden comment: Multilayer Ceramic Capacitor)
C51  value 33pF  Case: 0402  Voltage: 6V3  [CAPACITOR_0402]  (hidden comment: Multilayer Ceramic Capacitor)
C52  value 33pF  Case: 0402  Voltage: 6V3  [CAPACITOR_0402]  (hidden comment: Multilayer Ceramic Capacitor)
C53  value 33pF  Case: 0402  Voltage: 6V3  [CAPACITOR_0402]  (hidden comment: Multilayer Ceramic Capacitor)
C54  value 33pF  Case: 0402  Voltage: 6V3  [CAPACITOR_0402]  (hidden comment: Multilayer Ceramic Capacitor)
C55  value 470nF  Case: 0402  Voltage: 6V3  [CAPACITOR_0402]  (hidden comment: Multilayer Ceramic Capacitors)
C56  value 1nF  Case: 0402  Voltage: 6V3  [CAPACITOR_0402]  (hidden comment: Multilayer Ceramic Capacitor)
C57  value 1nF  Case: 0402  Voltage: 6V3  [CAPACITOR_0402]  (hidden comment: Multilayer Ceramic Capacitor)
C120  value 33pF  Case: 0402  Voltage: 6V3  [CAPACITOR_0402]  (hidden comment: Multilayer Ceramic Capacitor)
C121  value 33pF  Case: 0402  Voltage: 6V3  [CAPACITOR_0402]  (hidden comment: Multilayer Ceramic Capacitor)
C122  value 470nF  Case: 0402  Voltage: 6V3  [CAPACITOR_0402]  (hidden comment: Multilayer Ceramic Capacitors)
C123  value 33pF  Case: 0402  Voltage: 6V3  [CAPACITOR_0402]  (hidden comment: Multilayer Ceramic Capacitor)
J3  SIM Holder Tray  Manufacturer_Name: Molex  Manufacturer_Part_Number: 47388-2001  [Connector - SIM Tray]
L2  value 1nH  Case: 0402  [INDUCTOR_0402]  (hidden comment: Fixed Inductor)
L3  value 1nH  Case: 0402  [INDUCTOR_0402]  (hidden comment: Fixed Inductor)
R23  value 0R  Case: 0402  [RESISTOR_0402]  (hidden comment: Thick Film Resistor)
R34  value 0R  Case: 0402  [RESISTOR_0402]  (hidden comment: Thick Film Resistor)
R48  value 0R  Case: 0402  [RESISTOR_0402]  (hidden comment: Thick Film Resistor)
R64  value 0R  Case: 0402  [RESISTOR_0402]  (hidden comment: Thick Film Resistor)
RF1  Antenna  [Connector_IPEX]
TP10  PCB - Test Point  [Test_Pad - Hole]  (value not drawn)  (no BOM)
TP11  PCB - Test Point  [Test_Pad - Hole]  (value not drawn)  (no BOM)
TP15  PCB - Test Point  [Test_Pad - Hole]  (value not drawn)  (no BOM)
TP16  PCB - Test Point  [Test_Pad - Hole]  (value not drawn)  (no BOM)
TP20  PCB - Test Point  [Test_Pad - Hole]  (value not drawn)  (no BOM)
U10  GE910 2G GSM Module  [GE910 2G GSM Modem]  (parts A,B of 2)
U11  MFF2 SIM Chip  [MFF2]

### Ports
GSM_1V8_DTR (in), GSM_1V8_ONOFF (in), GSM_1V8_PMON, GSM_1V8_RX (in), GSM_1V8_SDOWN (in), GSM_1V8_STAT (out), GSM_1V8_TX (out), GSM_1V8_TXMON (out), VIOT1, VIOT2

### Nets
GND: C46.1 C51.1 C52.1 C53.1 C54.1 C55.1 C56.1 C57.1 C120.1 C121.1 C122.1 C123.1 J3.5(GND) L2.1 L3.1 R34.1 R64.1 RF1.2(GND) U10.A02(GND) U10.A04(SIMIN) U10.B13(GND) U10.E01(GND) U10.E02(GND) U10.E14(GND) U10.F02(GND) U10.G01(GND) U10.G02(GND) U10.H01(GND) U10.H02(GND) U10.J01(GND) U10.J02(GND) U10.K02(GND) U10.L01(GND) U10.L02(GND) U10.M03(GND) U10.M04(GND) U10.M12(GND) U10.N03(GND) U10.N04(GND) U10.N05(GND) U10.N06(GND) U10.P03(GND) U10.P04(GND) U10.P05(GND) U10.P06(GND) U10.P08(GND) U10.P09(GND) U10.P10(GND) U10.P13(GND) U10.R02(GND) U10.R03(GND) U10.R04(GND) U10.R05(GND) U10.R06(GND) U10.R08(GND) U10.R10(GND) U11.1(GND)
ANTENNA_2G: C57.2 L3.2 R23.1 RF1.1(Signal)
GSM_1V8_DTR: U10.M14(C108/DTR) ; port GSM_1V8_DTR
GSM_1V8_ONOFF: U10.R12(ON_OFF*) ; port GSM_1V8_ONOFF
GSM_1V8_PMON: U10.R11(VAUX/PWRMON) ; port GSM_1V8_PMON
GSM_1V8_RX: U10.N15(C103/TXD) ; port GSM_1V8_RX
GSM_1V8_SDOWN: U10.R13(HW_SHUTDOWN*) ; port GSM_1V8_SDOWN
GSM_1V8_STAT: U10.C08(GPIO_01) ; port GSM_1V8_STAT
GSM_1V8_TX: U10.M15(C104/RXD) ; port GSM_1V8_TX
GSM_1V8_TXMON: U10.B14(GPIO_05) ; port GSM_1V8_TXMON
GSM_ANTENNA_2G: C56.2 L2.2 R23.2 U10.K01(ANTENNA)
GSM_RX_AUX: TP16.1 U10.E15(RX_AUX)
GSM_TX_AUX: TP11.1 U10.D15(TX_AUX)
GSM_USB_D+: TP15.1 U10.B15(USB_D+)
GSM_USB_D-: TP20.1 U10.C15(USB_D-)
GSM_USB_VUSB: TP10.1 U10.A13(VUSB)
SIM_CLK: C52.2 C120.2 J3.3(CLK) U10.A06(SIMCLK) U11.6(CLK)
SIM_IO: C46.2 C51.2 J3.7(I/O) U10.A05(SIMIO) U11.3(I/O)
SIM_RST: C53.2 C121.2 J3.2(RST) U10.A07(SIMRST) U11.7(RST)
SIM_VCC: C54.2 C55.2 C122.2 C123.2 J3.1(VCC) U10.A03(SIMVCC) U11.8(VCC)
VIOT1: U10.M01(VBATT) U10.M02(VBATT) ; port VIOT1
VIOT2: U10.N01(VBATT_PA) U10.N02(VBATT_PA) U10.P01(VBATT_PA) U10.P02(VBATT_PA) ; port VIOT2
NetR34_2: R34.2 U10.D04(X_GND)
NetR48_1: R48.1 U10.E13(VIO1_1V8)
NetR48_2: R48.2 U10.D13(VDD_IO1)
NetR64_2: R64.2 U10.L14(C105/RTS)

Not connected (* = marked no-connect by the designer): U10 A08(RESERVED)* A09(RESERVED)* A10(RESERVED)* A11(RESERVED)* A12(RESERVED)* A14(RESERVED)* B01(ADC_IN1)* B02(EAR+)* B03(EAR-)* B04(MIC+)* B05(MIC-)* B06(DVI_RX)* B07(DVI_TX)* B08(DVI_CLK)* B09(DVI_WA0)* B10(RESERVED)* B11(RESERVED)* B12(RESERVED)* C01(RESERVED)* C02(RESERVED)* C03(RESERVED)* C04(RESERVED)* C05(RESERVED)* C06(RESERVED)* C07(RESERVED)* C09(GPIO_02)* C10(GPIO_03)* C11(GPIO_04)* C12(GPIO_06)* C13(GPIO_07)* C14(VRTC)* D01(RESERVED)* D02(RESERVED)* D03(RESERVED)* D12(RESERVED)* D14(RESERVED)* E03(RESERVED)* F01(RESERVED)* F03(RESERVED)* F13(RESERVED)* F14(RESERVED)* F15(RESERVED)* G03(RESERVED)* G13(RESERVED)* G14(GNSS_EN*)* G15(GPIO_10)* H03(RESERVED)* H13(RESERVED)* H14(RESERVED)* H15(RESERVED)* J03(RESERVED)* J13(RESERVED)* J14(GNSS_NMEA_TX)* J15(RESERVED)* K03(RESERVED)* K13(RESERVED)* K14(GNSS_NMEA_RX)* K15(GPIO_08)* L03(RESERVED)* L13(RESERVED)* L15(GPIO_09)* M13(RESERVED)* N07(RESERVED)* N08(RESERVED)* N09(RESERVED)* N10(RESERVED)* N11(RESERVED)* N12(RESERVED)* N13(RESERVED)* N14(C109/DCD)* P07(RESERVED)* P11(RESERVED)* P12(RESERVED)* P14(C107/DSR)* P15(C106/CTS)* R07(GNSS_LNA_EN)* R09(ANT_GNSS)* R14(C125/RING)*; U11 2(NC) 4(NC) 5(NC)

### Layout directives
rule Impedance Constraint [Min = 49.00    Max = 50.00    ]; rule Power Plane Clearance [Clearance = 5.906mil]; rule Width Constraint [Pref Width = 0.77mm    Min Width = 0.77mm    Max Width = 0.77mm]: ANTENNA_2G, GSM_ANTENNA_2G

### Notes on the sheet
- B106AA is compatable with 3 type of SIM usage.
  * Embedded (on GE910)
  * eSIM (MFF2)
  * SIM Tray
  One of these SIM type is used.
- GE910QUAD-V3 has no GNSS option. These pins are marked as NC.
- B106AA has no voice option so Digital and Analog voice pins marked as NC.
- GE910QUAD-V3 has no USB output. These connections for GE910QUAD version (if assembled).
- ADC and RTC functions are not used in B106AA.
- OnBoard eSIM Chip
- OnBoard Sim Tray
- Antenna Match Network
- SIM_VCC capacitor is chosed according Telit SIM integration guide.
- SIM Tray is only assembled when Simwise or E-Sim is not used.
- RF Matching network circuit is not placed on production. Only 0R resistor is placed.
- External SIM (MFF2) is only assembled when GE910QUAD-V3 (not simwise) module is assembled.
- E1
- Title
- Size:
- Date:
- A3
- Number:
- Time:
- Revision:
- Sheet
- of
- File:
- (in symbol IC - Telit GE910QUAD, part A) POWER; UART; UART2; I/O Ports; SIM; GNSS; Analog Voice; USB; Digital Voice; Control

### Library data of the parts
C46 C51-C54 C120 C121 C123 = Capacitor - 33pF [0402-6V3]: Capacitor - 33pF [0402] (Ceramic); Manufacturer_Name: Kemet; Manufacturer_Part_Number: C0402C330J9RACAUTO; Dielectric: X7R; Tolerance: 10%; Height: 0.5mm; Mouser_Part_Number: 80-C0402C330J9RAUTO; Maximum Operating Temperature: +125; Minimum Operating Temperature: -55; ROHS: Yes; ComponentLink1Description: DataSheet; ComponentLink1URL: https://api.kemet.com/component-edge/download/datasheet/C0402C330J9RACAUTO.pdf; ComponentLink2Description: Mouser; ComponentLink2URL: https://www.mouser.com/Search/Refine.aspx?Keyword=80-C0402C330J9RAUTO; Supplier 1: Mouser; Supplier Part Number 1: 80-C0402C330J9RAUTO
C55 C122 = Capacitor - 470nF [0402-6V3]: Capacitor - 470nF [0402] (Ceramic); Manufacturer_Name: AVX; Manufacturer_Part_Number: 04026C474KAT2A; Dielectric: X7R; Tolerance: %10; Height: 0.4mm; Mouser_Part_Number: 581-04026C474KAT2A; ComponentLink1Description: Mouser; ComponentLink1URL: https://www.mouser.com.tr/ProductDetail/AVX/04026D104KAT4A?qs=sGAEpiMZZMs0AnBnWHyRQPg4iYkCw7IMED%2F4kpqgf7w%3D; ComponentLink2Description: DataSheet; ComponentLink2URL: https://www.mouser.com.tr/datasheet/2/40/cx5r-776519.pdf; ROHS: Yes; Maximum Operating Temperature: +125; Minimum Operating Temperature: -55; Supplier 1: Mouser; Supplier Part Number 1: 581-04026C474KAT2A
C56 C57 = Capacitor - 1nF [0402-6V3): Capacitor - 1nF [0402] (Ceramic); Manufacturer_Name: AVX; Manufacturer_Part_Number: 04026C102MAT2A; Dielectric: X7R; Tolerance: 20%; Height: 0.25mm; Mouser_Part_Number: 581-04026C102MAT2A; Mouser Price/Stock: 0.074; Maximum Operating Temperature: +125; Minimum Operating Temperature: -55; ROHS: Yes; Weight: 0.65mg; ComponentLink1Description: Datasheet; ComponentLink1URL: https://www.mouser.com.tr/datasheet/2/40/X7RDielectric-777024.pdf; Supplier 1: Mouser; Supplier Part Number 1: 581-04026C102MAT2A
J3 = Connector - Sim Holder: Memory Card Connectors ASSY 1.90 SIM CARD R IM CARD READER CONN.; Card Type: Mini SIM; Mouser_Part_Number: 538-47388-2001; Supplier 1: Arrow; Supplier 2: Mouser; Supplier 3: Farnell; Supplier Part Number 1: 47388-2001; Supplier Part Number 2: 538-47388-2001; Supplier Part Number 3: 2426322
L2 L3 = Inductor - 1nH [0402]: Manufacturer_Name: Murata Electronics; Manufacturer_Part_Number: LQG15HN1N0S02D; Tolerance: 0.3 nH; Height: 0.35mm; Mouser_Part_Number: 81-LQG15HN1N0S02D; ComponentLink1Description: DataSheet; ComponentLink1URL: https://www.mouser.com.tr/datasheet/2/281/JELF243B-0009-1699631.pdf; ComponentLink2Description: Mouser; ComponentLink2URL: https://www.mouser.com.tr/ProductDetail/Murata-Electronics/LQG15HN1N0S02D?qs=sGAEpiMZZMsg%252By3WlYCkUySk0uOsB1dTfJeMbA4C8Pk%3D; Supplier 1: Future Electronics; Supplier 2: Future Electronics; Supplier 3: Mouser; Supplier 4: Arrow; Supplier 5: Digi-Key; Supplier Part Number 1: LQG15HN1N0S02D-CUTT; Supplier Part Number 2: LQG15HN1N0S02D-REEL; Supplier Part Number 3: 81-LQG15HN1N0S02D; Supplier Part Number 4: LQG15HN1N0S02D; Supplier Part Number 5: 490-1073-1-ND
R23 R34 R48 R64 = Resistor - 0R: Thick Film Resistors - SMD 1/16 W 0 Ohms; Manufacturer_Name: Vishay; Manufacturer_Part_Number: CRCW04020000Z0ED; Height: 0.4mm; Mouser_Part_Number: 71-CRCW0402-0-E3; ComponentLink1Description: DataSheet; ComponentLink1URL: https://www.mouser.com.tr/datasheet/2/427/dcrcwe3-1762152.pdf; ComponentLink2Description: Mouser; ComponentLink2URL: https://www.mouser.com.tr/ProductDetail/Vishay-Dale/CRCW04020000Z0ED?qs=sGAEpiMZZMu61qfTUdNhG2DpbjADlD3GG34cJb50zyg%3D; Supplier 1: Mouser; Supplier 2: Digi-Key; Supplier Part Number 1: 71-CRCW0402-0-E3; Supplier Part Number 2: 541-0.0JCT-ND
RF1 = Connector - MHF: MHF Antenna Socket; ROHS: Yes; Supplier 1: Mouser; Supplier 2: Arrow; Supplier Part Number 1: 200-RSP-122811-01; Supplier Part Number 2: RSP-122811-01
TP10 TP11 TP15 TP16 TP20 = PCB - Test Point: Test Point
U10 = IC - Telit GE910QUAD: Telit GE910 GPRS/UMTS Module; Supplier: Telit; Value: GE910QUAD; ComponentLink1Description: Product Page; ComponentLink1URL: https://www.telit.com/product-series/ge910/
U11 = IC - MFF2: SIM Chip MFF2

## Sheet GSM LED Indicators.SchDoc: GSM Modem Signal Indicator LED's
size A4; ApprovedBy: Mehmet Günce Akkoyun; CheckedBy: Mehmet Günce Akkoyun; Author: Mehmet Günce Akkoyun; CompanyName: Ovoo Electronics; DrawnBy: Mehmet Günce Akkoyun; Engineer: Mehmet Günce Akkoyun; Organization: Ovoo Electronics; Address1: Küçük Ýhsaniye Mah.; Address2: Mýzraklý Sok. No:15; Address3: Meram / Konya; Address4: Turkiye; DocumentNumber: AA005; Revision: B106AA; SheetNumber: 25; SheetTotal: 37
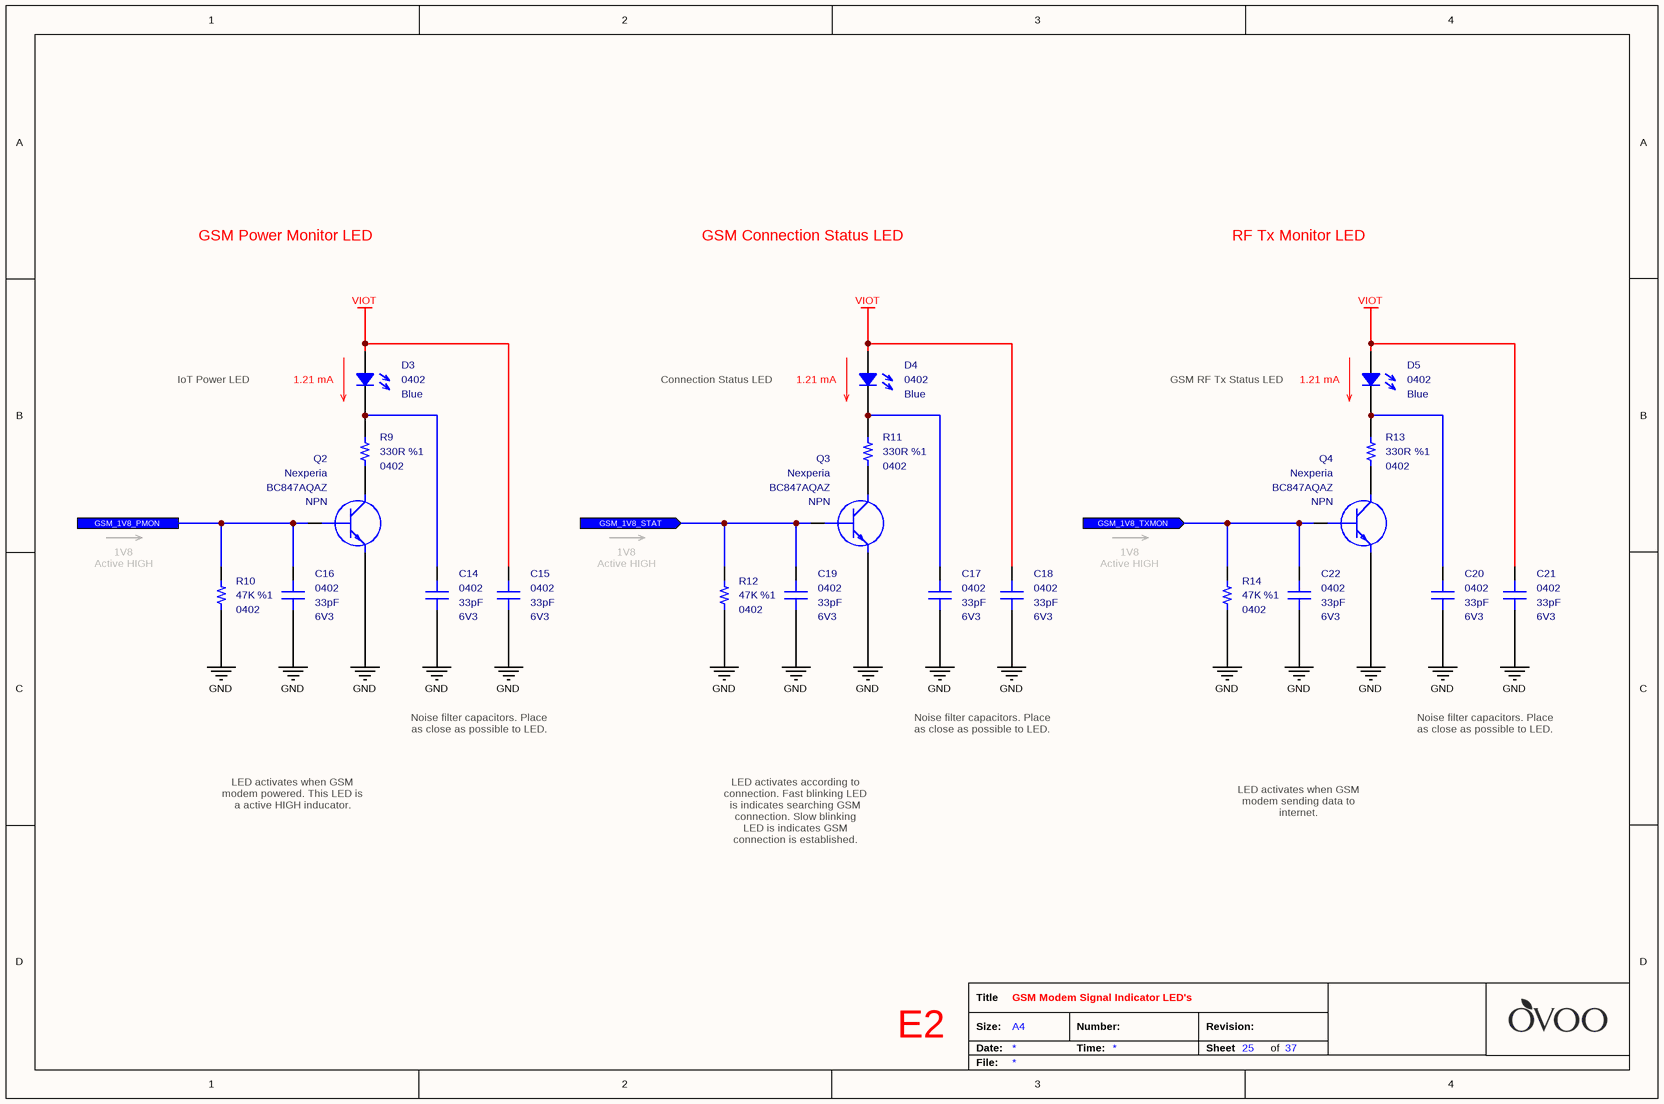
[diagram p18: GSM LED Indicators.SchDoc]

### Parts
C14  value 33pF  Case: 0402  Voltage: 6V3  [CAPACITOR_0402]  (hidden comment: Multilayer Ceramic Capacitor)
C15  value 33pF  Case: 0402  Voltage: 6V3  [CAPACITOR_0402]  (hidden comment: Multilayer Ceramic Capacitor)
C16  value 33pF  Case: 0402  Voltage: 6V3  [CAPACITOR_0402]  (hidden comment: Multilayer Ceramic Capacitor)
C17  value 33pF  Case: 0402  Voltage: 6V3  [CAPACITOR_0402]  (hidden comment: Multilayer Ceramic Capacitor)
C18  value 33pF  Case: 0402  Voltage: 6V3  [CAPACITOR_0402]  (hidden comment: Multilayer Ceramic Capacitor)
C19  value 33pF  Case: 0402  Voltage: 6V3  [CAPACITOR_0402]  (hidden comment: Multilayer Ceramic Capacitor)
C20  value 33pF  Case: 0402  Voltage: 6V3  [CAPACITOR_0402]  (hidden comment: Multilayer Ceramic Capacitor)
C21  value 33pF  Case: 0402  Voltage: 6V3  [CAPACITOR_0402]  (hidden comment: Multilayer Ceramic Capacitor)
C22  value 33pF  Case: 0402  Voltage: 6V3  [CAPACITOR_0402]  (hidden comment: Multilayer Ceramic Capacitor)
D3  Case: 0402  Color: Blue  [LED_0402]  (hidden comment: SMD LED (Blue))
D4  Case: 0402  Color: Blue  [LED_0402]  (hidden comment: SMD LED (Blue))
D5  Case: 0402  Color: Blue  [LED_0402]  (hidden comment: SMD LED (Blue))
Q2  Manufacturer_Name: Nexperia  Manufacturer_Part_Number: BC847AQAZ  Polarity: NPN  [SOT1215]  (hidden comment: Bipolar NPN Transistors)
Q3  Manufacturer_Name: Nexperia  Manufacturer_Part_Number: BC847AQAZ  Polarity: NPN  [SOT1215]  (hidden comment: Bipolar NPN Transistors)
Q4  Manufacturer_Name: Nexperia  Manufacturer_Part_Number: BC847AQAZ  Polarity: NPN  [SOT1215]  (hidden comment: Bipolar NPN Transistors)
R9  value 330R  Tolerance: %1  Case: 0402  [RESISTOR_0402]  (hidden comment: Thick Film Resistor)
R10  value 47K  Tolerance: %1  Case: 0402  [RESISTOR_0402]  (hidden comment: Thick Film Resistor)
R11  value 330R  Tolerance: %1  Case: 0402  [RESISTOR_0402]  (hidden comment: Thick Film Resistor)
R12  value 47K  Tolerance: %1  Case: 0402  [RESISTOR_0402]  (hidden comment: Thick Film Resistor)
R13  value 330R  Tolerance: %1  Case: 0402  [RESISTOR_0402]  (hidden comment: Thick Film Resistor)
R14  value 47K  Tolerance: %1  Case: 0402  [RESISTOR_0402]  (hidden comment: Thick Film Resistor)

### Ports
GSM_1V8_PMON, GSM_1V8_STAT (in), GSM_1V8_TXMON (in)

### Nets
GND: C14.2 C15.2 C16.2 C17.2 C18.2 C19.2 C20.2 C21.2 C22.2 Q2.2(E) Q3.2(E) Q4.2(E) R10.1 R12.1 R14.1
VIOT: C15.1 C18.1 C21.1 D3.2 D4.2 D5.2
GSM_1V8_PMON: C16.1 Q2.1(B) R10.2 ; port GSM_1V8_PMON
GSM_1V8_STAT: C19.1 Q3.1(B) R12.2 ; port GSM_1V8_STAT
GSM_1V8_TXMON: C22.1 Q4.1(B) R14.2 ; port GSM_1V8_TXMON
NetC14_1: C14.1 D3.1 R9.2
NetC17_1: C17.1 D4.1 R11.2
NetC20_1: C20.1 D5.1 R13.2
NetQ2_3: Q2.3(C) R9.1
NetQ3_3: Q3.3(C) R11.1
NetQ4_3: Q4.3(C) R13.1

### Notes on the sheet
- GSM Power Monitor LED
- GSM Connection Status LED
- RF Tx Monitor LED
- IoT Power LED
- (near D3) 1.21 mA
- Connection Status LED
- (near D4) 1.21 mA
- GSM RF Tx Status LED
- (near D5) 1.21 mA
- 1V8
  Active HIGH
- Noise filter capacitors. Place as close as possible to LED.
- LED activates when GSM modem powered. This LED is a active HIGH inducator.
- LED activates according to connection. Fast blinking LED is indicates searching GSM connection. Slow blinking LED is indicates GSM connection is established.
- LED activates when GSM modem sending data to internet.
- E2
- Title
- Size:
- Date:
- A4
- Number:
- Time:
- Revision:
- Sheet
- of
- File:

### Library data of the parts
C14-C22 = Capacitor - 33pF [0402-6V3]: as C46 on sheet GE910QUAD Modem; Height: 0.5mm; Mouser_Part_Number: 80-C0402C330J9RAUTO; Maximum Operating Temperature: +125; Minimum Operating Temperature: -55; ROHS: Yes; ComponentLink1Description: DataSheet; ComponentLink1URL: https://api.kemet.com/component-edge/download/datasheet/C0402C330J9RACAUTO.pdf; ComponentLink2Description: Mouser; ComponentLink2URL: https://www.mouser.com/Search/Refine.aspx?Keyword=80-C0402C330J9RAUTO; Supplier 1: Mouser; Supplier Part Number 1: 80-C0402C330J9RAUTO
D3-D5 = Diode - LED (0402-Blue): Standard LEDs - SMD PICOLEDTM;BLUE LED; 25M @ 5MA; Manufacturer_Name: ROHM Semiconductor; Manufacturer_Part_Number: SMLP13BC8TT86; Mouser_Part_Number: 755-SMLP13BC8TT86; ROHS: Yes; ComponentLink1Description: DataSheet; ComponentLink1URL: https://d1d2qsbl8m0m72.cloudfront.net/en/products/databook/datasheet/opto/led/chip_mono/sml-p1-e.pdf; ComponentLink2Description: Mouser; ComponentLink2URL: https://www.mouser.com.tr/ProductDetail/ROHM-Semiconductor/SMLP13BC8TT86?qs=%2Fha2pyFaduidYDgXFKL%252BNZwCVZNUI4FlyPWWbVDx1b6ABmzS%252BS2f0w%3D%3D; Supplier 1: Mouser; Supplier 2: Digi-Key; Supplier Part Number 1: 755-SMLP13BC8TT86; Supplier Part Number 2: 846-1112-1-ND
Q2-Q4 = Transistor - BC847: Bipolar Transistors - BJT BC847AQA/DFN1010D-3/REEL 7" Q2; Mouser_Part_Number: 771-BC847AQAZ; ComponentLink1Description: DataSheet; ComponentLink1URL: https://www.mouser.com.tr/datasheet/2/916/BC847XQA_SER-1598405.pdf; ComponentLink2Description: Mouser; ComponentLink2URL: https://www.mouser.com.tr/ProductDetail/Nexperia/BC847AQAZ?qs=%2Fha2pyFaduhKMCPKNtQimeJpXTw9z4AqURd2YARs8DVICZNv3AT9Dw%3D%3D; Case: DFN-1010D-3; Supplier 1: Mouser; Supplier 2: Digi-Key; Supplier Part Number 1: 771-BC847AQAZ; Supplier Part Number 2: 1727-2545-1-ND
R9 R11 R13 = Resistor - 330R: Thick Film Resistors - SMD 1/16 W 330 Ohm 1%; Manufacturer_Name: Vishay; Manufacturer_Part_Number: CRCW0402330RFKED; Height: 0.4mm; Mouser_Part_Number: 71-CRCW0402-330-E3; ComponentLink1Description: DataSheet; ComponentLink1URL: https://www.mouser.com.tr/datasheet/2/427/dcrcwe3-1762152.pdf; ComponentLink2Description: Mouser; ComponentLink2URL: https://www.mouser.com.tr/ProductDetail/Vishay-Dale/CRCW0402330RFKED?qs=sGAEpiMZZMu61qfTUdNhG2DpbjADlD3GGS6SwBlLi5Q%3D; Supplier 1: Mouser; Supplier 2: Digi-Key; Supplier Part Number 2: 541-330LCT-ND; Supplier Part Number 1: 71-CRCW0402-330-E3
R10 R12 R14 = Resistor - 47K: Thick Film Resistors - SMD 1/16 W 47 Kohms 1%; Manufacturer_Name: Vishay; Manufacturer_Part_Number: CRCW040247K0FKED; Height: 0.4mm; Mouser_Part_Number: 71-CRCW0402-47K-E3; ComponentLink1Description: DataSheet; ComponentLink1URL: https://www.mouser.com.tr/datasheet/2/427/dcrcwe3-1762152.pdf; ComponentLink2Description: Mouser; ComponentLink2URL: https://www.mouser.com.tr/ProductDetail/Vishay-Dale/CRCW040247K0FKED?qs=sGAEpiMZZMu61qfTUdNhG2DpbjADlD3GL%252B3h1elTxqU%3D; Supplier 1: Mouser; Supplier 2: Digi-Key; Supplier Part Number 1: 71-CRCW040247K0FKEDH; Supplier Part Number 2: 541-47.0KYCT-ND

## Sheet Bidirectional Voltage Translator.SchDoc: 3V3 - 1V8 Voltage Level Translator
size A3; ApprovedBy: Mehmet Günce Akkoyun; CheckedBy: Mehmet Günce Akkoyun; Author: Mehmet Günce Akkoyun; CompanyName: Ovoo Electronics; DrawnBy: Mehmet Günce Akkoyun; Engineer: Mehmet Günce Akkoyun; Organization: Ovoo Electronics; Address1: Küçük Ýhsaniye Mah.; Address2: Mýzraklý Sok. No:15; Address3: Meram / Konya; Address4: Turkiye; DocumentNumber: AA005; Revision: B106AA; SheetNumber: 26; SheetTotal: 37
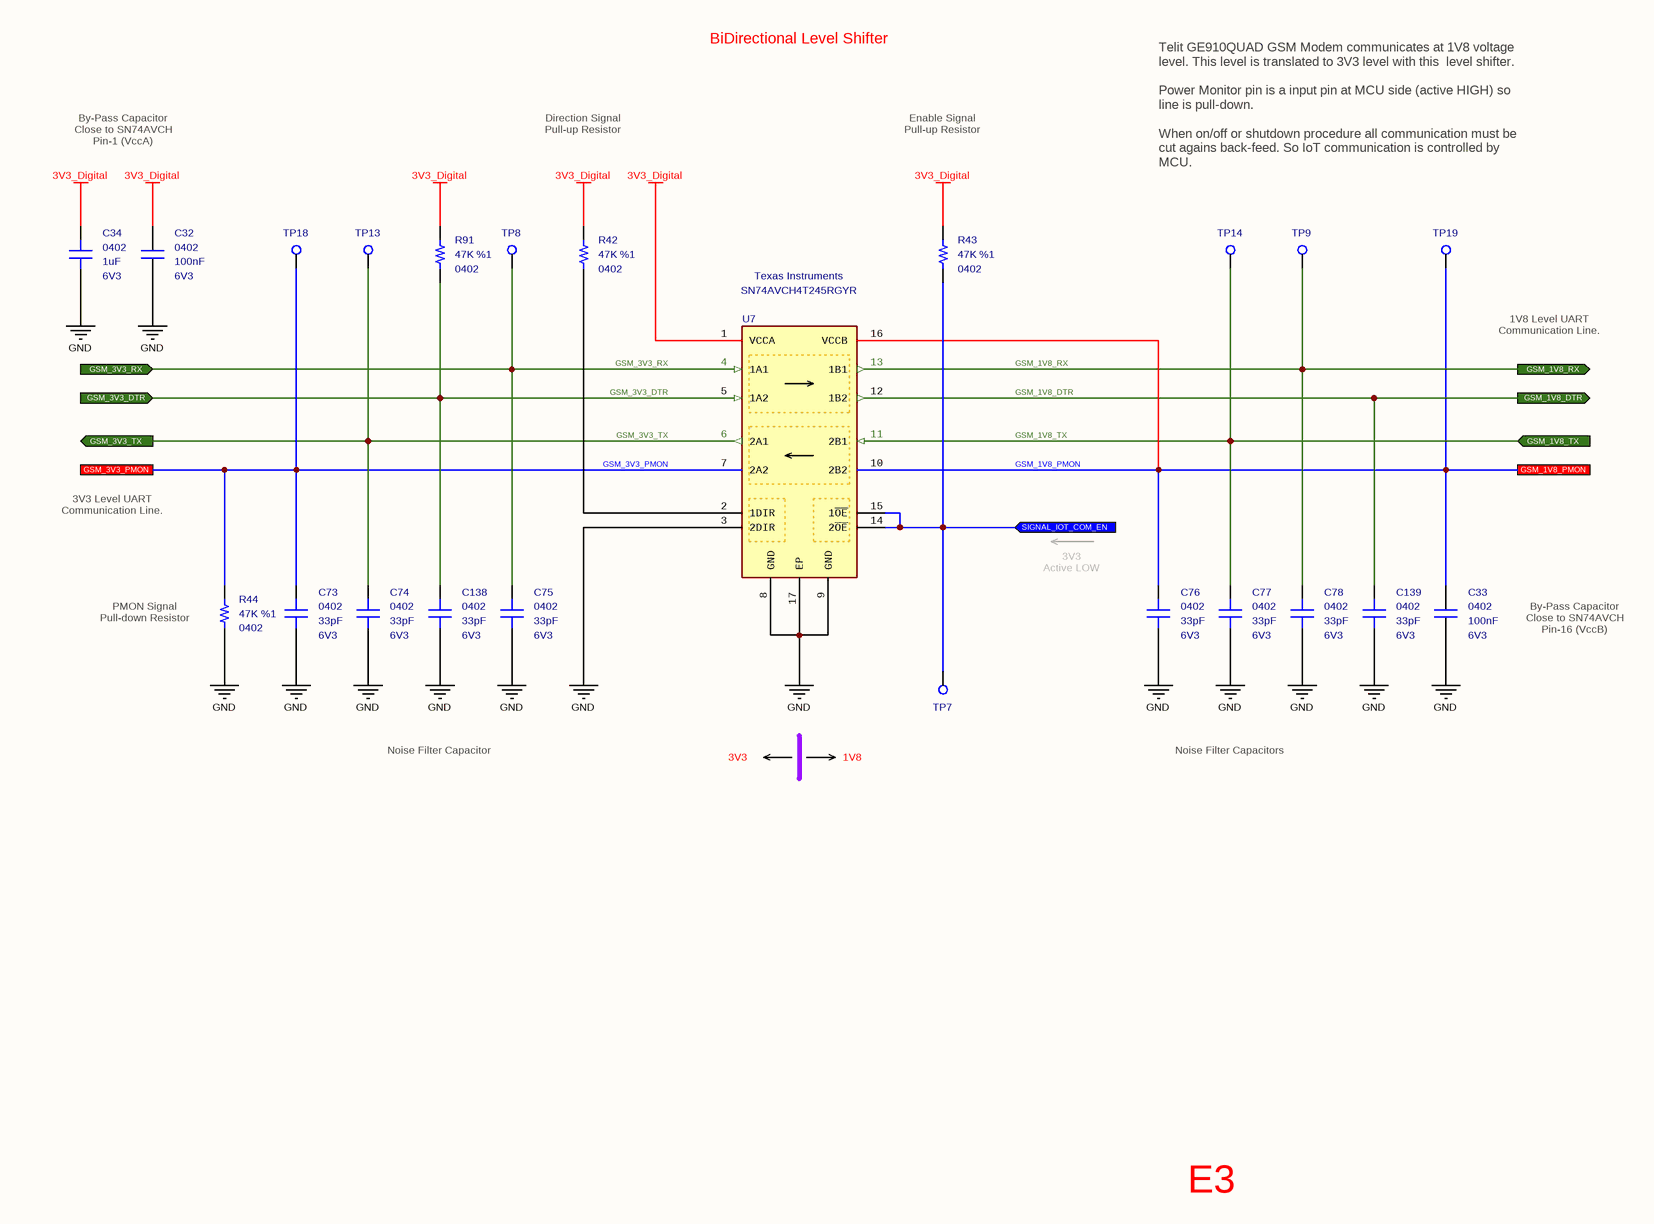
[diagram p19: Bidirectional Voltage Translator.SchDoc]

### Parts
C32  value 100nF  Case: 0402  Voltage: 6V3  [CAPACITOR_0402]  (hidden comment: Multilayer Ceramic Capacitor)
C33  value 100nF  Case: 0402  Voltage: 6V3  [CAPACITOR_0402]  (hidden comment: Multilayer Ceramic Capacitor)
C34  value 1uF  Case: 0402  Voltage: 6V3  [CAPACITOR_0402]  (hidden comment: Multilayer Ceramic Capacitor)
C73  value 33pF  Case: 0402  Voltage: 6V3  [CAPACITOR_0402]  (hidden comment: Multilayer Ceramic Capacitor)
C74  value 33pF  Case: 0402  Voltage: 6V3  [CAPACITOR_0402]  (hidden comment: Multilayer Ceramic Capacitor)
C75  value 33pF  Case: 0402  Voltage: 6V3  [CAPACITOR_0402]  (hidden comment: Multilayer Ceramic Capacitor)
C76  value 33pF  Case: 0402  Voltage: 6V3  [CAPACITOR_0402]  (hidden comment: Multilayer Ceramic Capacitor)
C77  value 33pF  Case: 0402  Voltage: 6V3  [CAPACITOR_0402]  (hidden comment: Multilayer Ceramic Capacitor)
C78  value 33pF  Case: 0402  Voltage: 6V3  [CAPACITOR_0402]  (hidden comment: Multilayer Ceramic Capacitor)
C138  value 33pF  Case: 0402  Voltage: 6V3  [CAPACITOR_0402]  (hidden comment: Multilayer Ceramic Capacitor)
C139  value 33pF  Case: 0402  Voltage: 6V3  [CAPACITOR_0402]  (hidden comment: Multilayer Ceramic Capacitor)
R42  value 47K  Tolerance: %1  Case: 0402  [RESISTOR_0402]  (hidden comment: Thick Film Resistor)
R43  value 47K  Tolerance: %1  Case: 0402  [RESISTOR_0402]  (hidden comment: Thick Film Resistor)
R44  value 47K  Tolerance: %1  Case: 0402  [RESISTOR_0402]  (hidden comment: Thick Film Resistor)
R91  value 47K  Tolerance: %1  Case: 0402  [RESISTOR_0402]  (hidden comment: Thick Film Resistor)
TP7  PCB - Test Point  [Test_Pad - Hole]  (value not drawn)  (no BOM)
TP8  PCB - Test Point  [Test_Pad - Hole]  (value not drawn)  (no BOM)
TP9  PCB - Test Point  [Test_Pad - Hole]  (value not drawn)  (no BOM)
TP13  PCB - Test Point  [Test_Pad - Hole]  (value not drawn)  (no BOM)
TP14  PCB - Test Point  [Test_Pad - Hole]  (value not drawn)  (no BOM)
TP18  PCB - Test Point  [Test_Pad - Hole]  (value not drawn)  (no BOM)
TP19  PCB - Test Point  [Test_Pad - Hole]  (value not drawn)  (no BOM)
U7  Manufacturer_Name: Texas Instruments  Manufacturer_Part_Number: SN74AVCH4T245RGYR  [VQFN16]  (hidden comment: Voltage Level Shifter)

### Ports
GSM_1V8_DTR (out), GSM_1V8_PMON, GSM_1V8_RX (out), GSM_1V8_TX (in), GSM_3V3_DTR (in), GSM_3V3_PMON, GSM_3V3_RX (in), GSM_3V3_TX (out), SIGNAL_IOT_COM_EN (in)

### Nets
3V3_Digital: C32.2 C34.2 R42.2 R43.2 R91.2 U7.1(VCCA)
GND: C32.1 C33.1 C34.1 C73.1 C74.1 C75.1 C76.1 C77.1 C78.1 C138.1 C139.1 R44.1 U7.3(2DIR) U7.8(GND) U7.9(GND) U7.17(EP)
GSM_1V8_DTR: C139.2 U7.12(1B2) ; port GSM_1V8_DTR
GSM_1V8_PMON: C33.2 C76.2 TP19.1 U7.10(2B2) U7.16(VCCB) ; port GSM_1V8_PMON
GSM_1V8_RX: C78.2 TP9.1 U7.13(1B1) ; port GSM_1V8_RX
GSM_1V8_TX: C77.2 TP14.1 U7.11(2B1) ; port GSM_1V8_TX
GSM_3V3_DTR: C138.2 R91.1 U7.5(1A2) ; port GSM_3V3_DTR
GSM_3V3_PMON: C73.2 R44.2 TP18.1 U7.7(2A2) ; port GSM_3V3_PMON
GSM_3V3_RX: C75.2 TP8.1 U7.4(1A1) ; port GSM_3V3_RX
GSM_3V3_TX: C74.2 TP13.1 U7.6(2A1) ; port GSM_3V3_TX
SIGNAL_IOT_COM_EN: R43.1 TP7.1 U7.14(2~{OE}) U7.15(1~{OE}) ; port SIGNAL_IOT_COM_EN
NetR42_1: R42.1 U7.2(1DIR)

### Notes on the sheet
- BiDirectional Level Shifter
- By-Pass Capacitor
  Close to SN74AVCH
  Pin-1 (VccA)
- Direction Signal
  Pull-up Resistor
- Enable Signal
  Pull-up Resistor
- Telit GE910QUAD GSM Modem communicates at 1V8 voltage level. This level is translated to 3V3 level with this  level shifter.
  Power Monitor pin is a input pin at MCU side (active HIGH) so line is pull-down.
  When on/off or shutdown procedure all communication must be cut agains back-feed. So IoT communication is controlled by MCU.
- 1V8 Level UART Communication Line.
- 3V3 Level UART Communication Line.
- (near C76) 3V3
  Active LOW
- (near R44) PMON Signal
  Pull-down Resistor
- By-Pass Capacitor
  Close to SN74AVCH
  Pin-16 (VccB)
- Noise Filter Capacitor
- 3V3
- 1V8
- Noise Filter Capacitors
- E3
- Title
- Size:
- Date:
- A3
- Number:
- Time:
- Revision:
- Sheet
- of
- File:

### Library data of the parts
C32 C33 = Capacitor - 100nF [0402-6V3]: Capacitor - 100nF [0402-6V3] (Ceramic); Manufacturer_Name: AVX; Manufacturer_Part_Number: 04026D104KAT4A; Dielectric: X5R; Tolerance: %10; Height: 0.25mm; Mouser_Part_Number: 581-04026D104KAT4A; ComponentLink1Description: Mouser; ComponentLink1URL: https://www.mouser.com.tr/ProductDetail/AVX/04026D104KAT4A?qs=sGAEpiMZZMs0AnBnWHyRQPg4iYkCw7IMED%2F4kpqgf7w%3D; ComponentLink2Description: DataSheet; ComponentLink2URL: https://www.mouser.com.tr/datasheet/2/40/cx5r-776519.pdf; ROHS: Yes; Maximum Operating Temperature: +85; Minimum Operating Temperature: -55; Supplier 1: Avnet; Supplier Part Number 1: 04026D104KAT4A
C34 = Capacitor - 1uF [0402-6V3): Capacitor - 1uF [0402] (Ceramic); Manufacturer_Name: Murata Electronics; Manufacturer_Part_Number: GRM153R60J105ME95D; Dielectric: X5R; Tolerance: 20%; Height: 0.3mm; Mouser_Part_Number: 81-GRM153R60J105ME5D; Maximum Operating Temperature: +85; Minimum Operating Temperature: -55; RoHS: Yes; Weight: 6mg; ComponentLink1Description: DataSheet; ComponentLink1URL: https://psearch.en.murata.com/capacitor/product/GRM153R60J105ME95%23.html; ComponentLink2Description: Mouser; ComponentLink2URL: https://www.mouser.com/Search/Refine.aspx?Keyword=81-GRM153R60J105ME5D; Supplier 1: Future Electronics; Supplier 2: Future Electronics; Supplier 3: Mouser; Supplier 4: Arrow; Supplier 5: Digi-Key; Supplier Part Number 5: 490-14576-1-ND; Supplier Part Number 4: GRM153R60J105ME95D; Supplier Part Number 3: 81-GRM153R60J105ME5D; Supplier Part Number 2: GRM153R60J105ME95D-REEL; Supplier Part Number 1: GRM153R60J105ME95D-CUTT
C73-C78 C138 C139 = Capacitor - 33pF [0402-6V3]: as C46 on sheet GE910QUAD Modem; Height: 0.5mm; Mouser_Part_Number: 80-C0402C330J9RAUTO; Maximum Operating Temperature: +125; Minimum Operating Temperature: -55; ROHS: Yes; ComponentLink1Description: DataSheet; ComponentLink1URL: https://api.kemet.com/component-edge/download/datasheet/C0402C330J9RACAUTO.pdf; ComponentLink2Description: Mouser; ComponentLink2URL: https://www.mouser.com/Search/Refine.aspx?Keyword=80-C0402C330J9RAUTO; Supplier 1: Mouser; Supplier Part Number 1: 80-C0402C330J9RAUTO
R42-R44 R91 = Resistor - 47K: as R10 on sheet GSM LED Indicators; Height: 0.4mm; Mouser_Part_Number: 71-CRCW0402-47K-E3; ComponentLink1Description: DataSheet; ComponentLink1URL: https://www.mouser.com.tr/datasheet/2/427/dcrcwe3-1762152.pdf; ComponentLink2Description: Mouser; ComponentLink2URL: https://www.mouser.com.tr/ProductDetail/Vishay-Dale/CRCW040247K0FKED?qs=sGAEpiMZZMu61qfTUdNhG2DpbjADlD3GL%252B3h1elTxqU%3D; Supplier 1: Mouser; Supplier 2: Digi-Key; Supplier Part Number 1: 71-CRCW040247K0FKEDH; Supplier Part Number 2: 541-47.0KYCT-ND
TP7-TP9 TP13 TP14 TP18 TP19 = PCB - Test Point: Test Point
U7 = IC - SN74AVCH4T245: Translation - Voltage Levels Low Power Dual Channel; Supply Voltage - Max: 3.6V; Supply Voltage - Min: 1.2V; Height: 1mm; Mouser_Part_Number: 595-SN74AVCH4T245RGY; ComponentLink1Description: DataSheet; ComponentLink1URL: http://www.ti.com/general/docs/suppproductinfo.tsp?distId=26&gotoUrl=http%3A%2F%2Fwww.ti.com%2Flit%2Fgpn%2Fsn74avch4t245; Maximum Operating Temperature: +85; Minimum Operating Temperature: -40; ComponentLink2Description: Mouser; ComponentLink2URL: https://www.mouser.com.tr/ProductDetail/Texas-Instruments/SN74AVCH4T245RGYR?qs=PVVDbbWpW3IMTHF1QV2g%252BQ==; Supplier 1: Mouser; Supplier 2: Arrow; Supplier 3: Digi-Key; Supplier Part Number 1: 595-SN74AVCH4T245RGY; Supplier Part Number 2: SN74AVCH4T245RGYR; Supplier Part Number 3: 296-18262-1-ND; Case: VQFN-16